# EAGLE schematic LautIOProto2 (EAGLE 9.6.2)

## Sheet 1 of 8
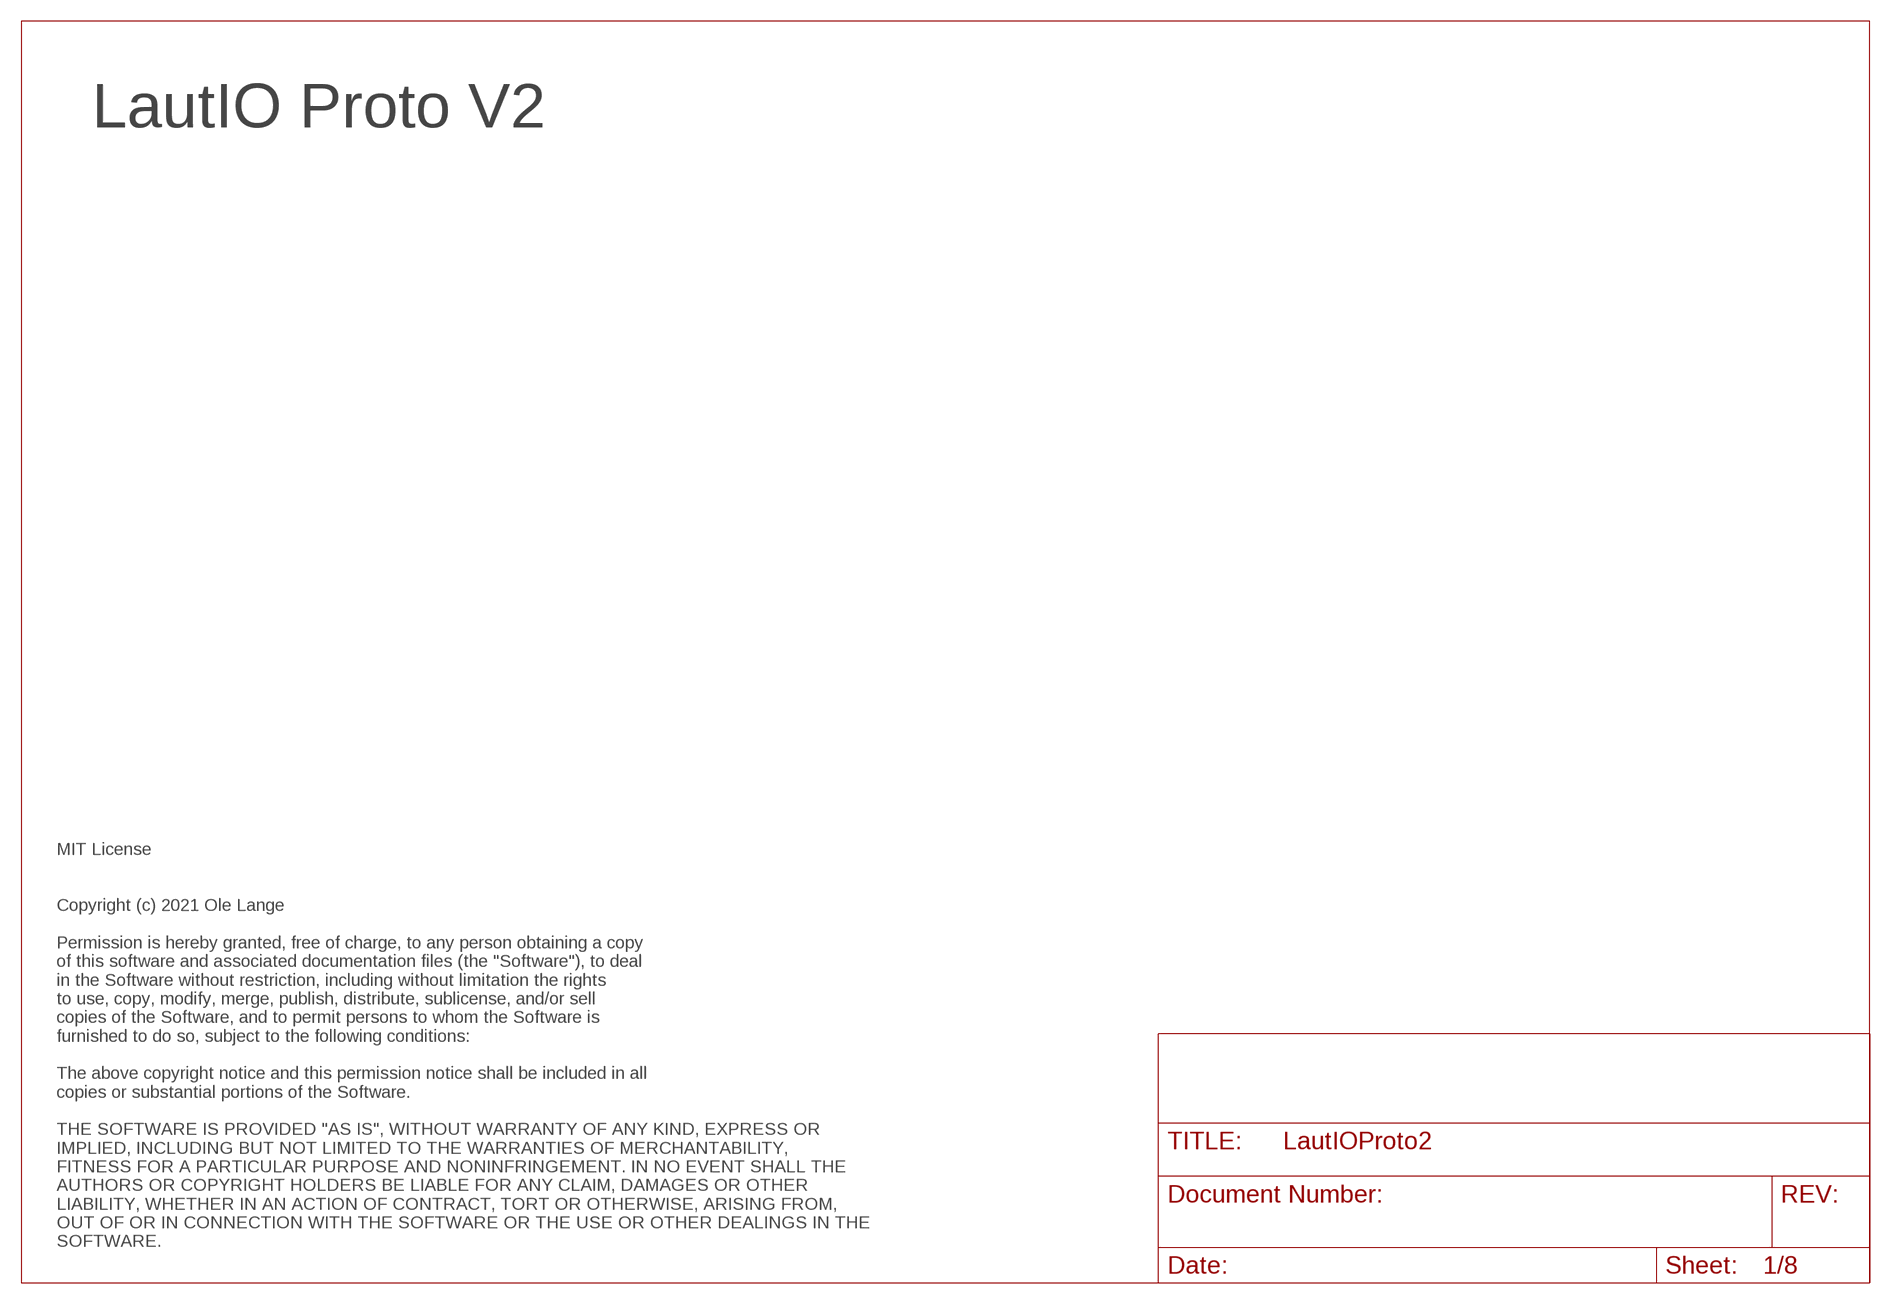
[diagram p0: schematic, sheet 1]

### Notes on the sheet
- LautIO Proto V2
- MIT License
  
  
  Copyright (c) 2021 Ole Lange
  
  Permission is hereby granted, free of charge, to any person obtaining a copy
  of this software and associated documentation files (the "Software"), to deal
  in the Software without restriction, including without limitation the rights
  to use, copy, modify, merge, publish, distribute, sublicense, and/or sell
  copies of the Software, and to permit persons to whom the Software is
  furnished to do so, subject to the following conditions:
  
  The above copyright notice and this permission notice shall be included in all
  copies or substantial portions of the Software.
  
  THE SOFTWARE IS PROVIDED "AS IS", WITHOUT WARRANTY OF ANY KIND, EXPRESS OR
  IMPLIED, INCLUDING BUT NOT LIMITED TO THE WARRANTIES OF MERCHANTABILITY,
  FITNESS FOR A PARTICULAR PURPOSE AND NONINFRINGEMENT. IN NO EVENT SHALL THE
  AUTHORS OR COPYRIGHT HOLDERS BE LIABLE FOR ANY CLAIM, DAMAGES OR OTHER
  LIABILITY, WHETHER IN AN ACTION OF CONTRACT, TORT OR OTHERWISE, ARISING FROM,
  OUT OF OR IN CONNECTION WITH THE SOFTWARE OR THE USE OR OTHER DEALINGS IN THE
  SOFTWARE.

## Sheet 2 of 8
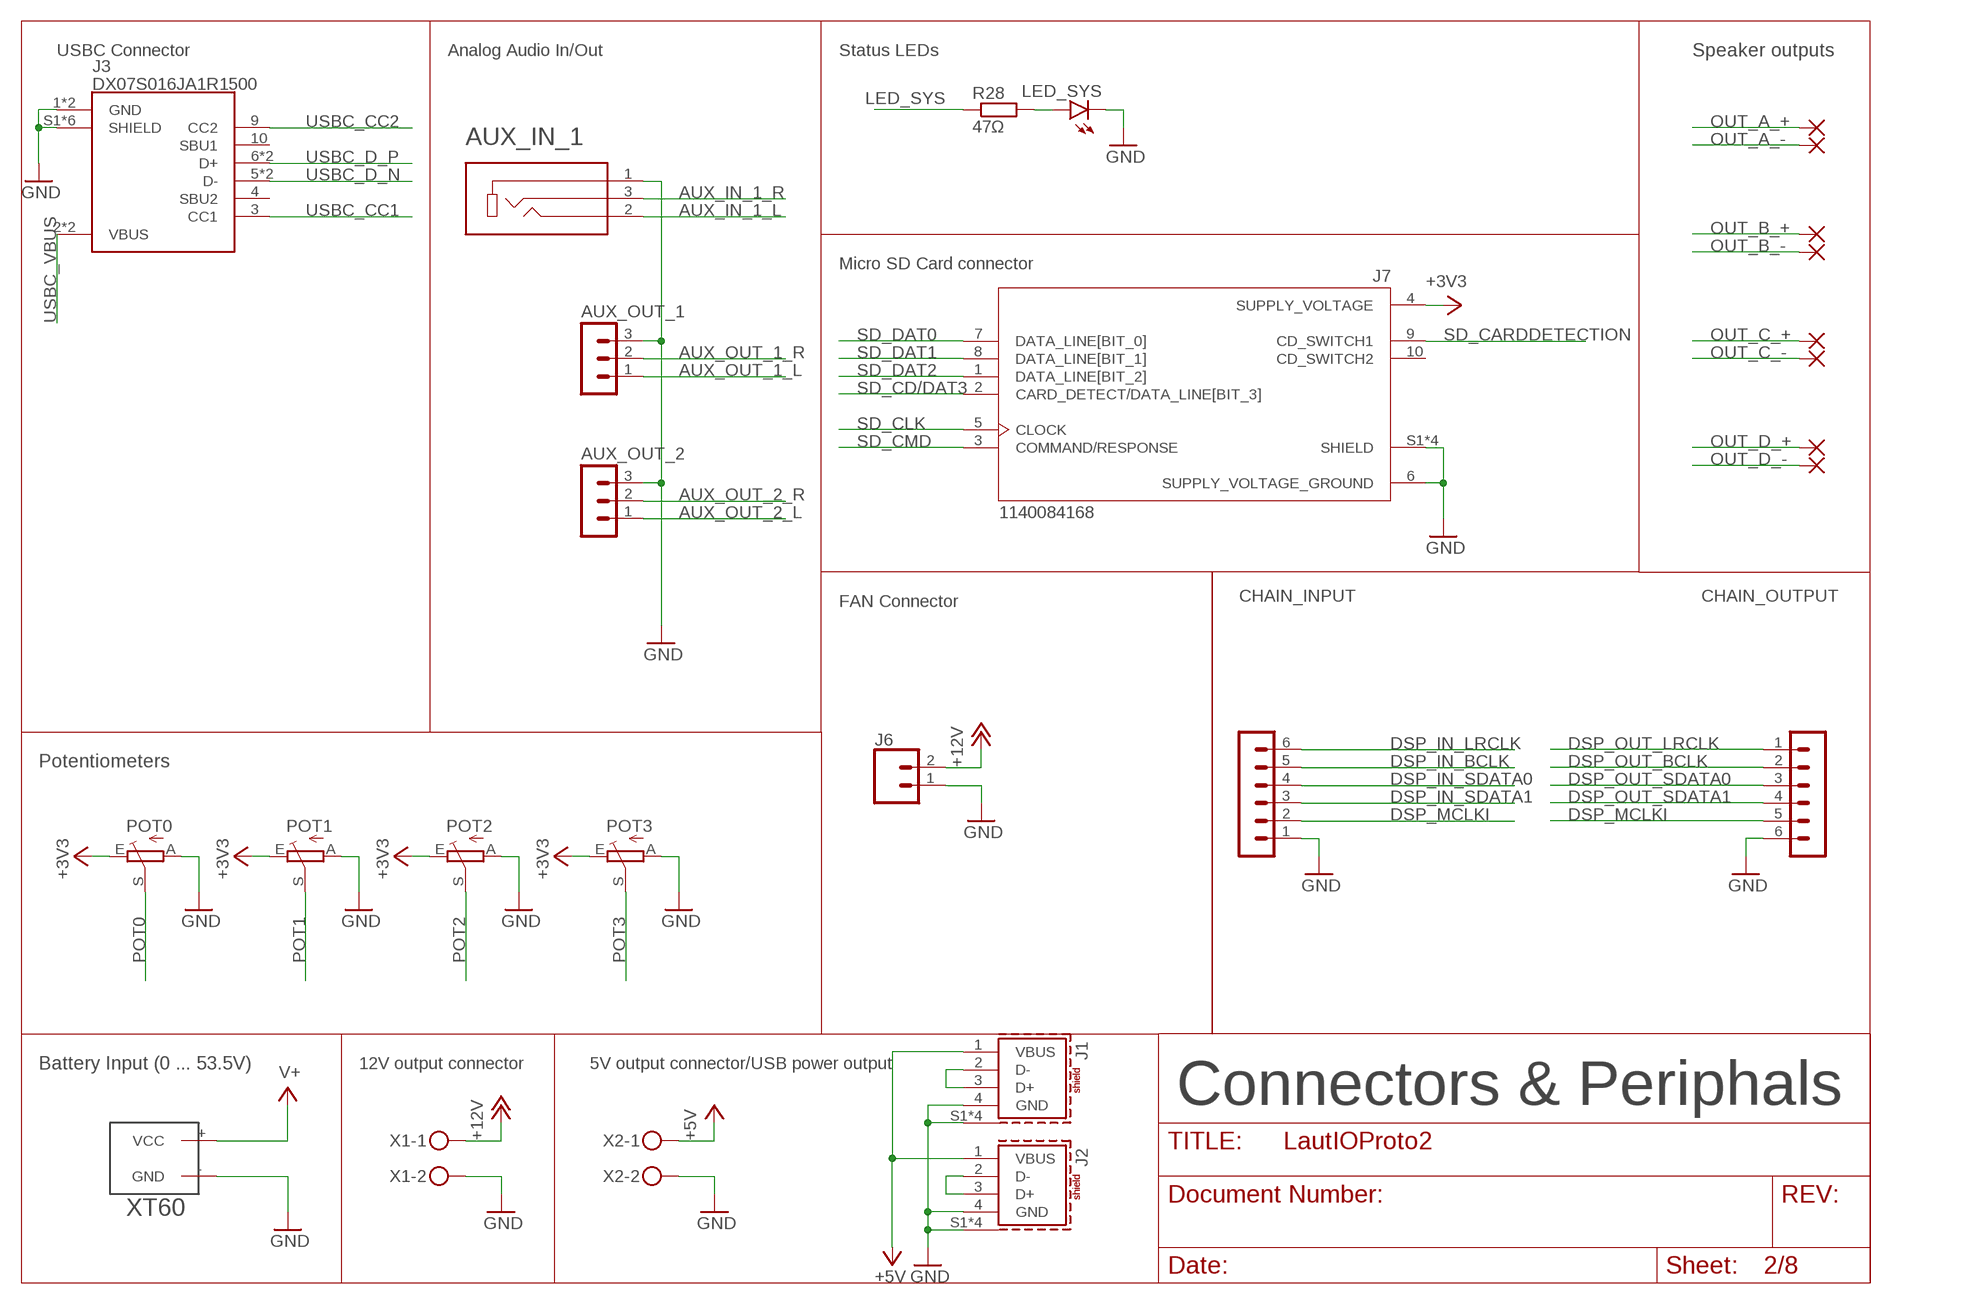
[diagram p1: schematic, sheet 2]

### Parts
AUX_IN_1  SJ1-3523N  [CUI_SJ1-3523N]
AUX_OUT_1  MA03-1  [MA03-1]
AUX_OUT_2  MA03-1  [MA03-1]
CHAIN_INPUT  MA06-1  [MA06-1]
CHAIN_OUTPUT  MA06-1  [MA06-1]
J1  614004134726  [614004134726]
J2  614004134726  [614004134726]
J3  DX07S016JA1R1500  [JAE_DX07S016JA1R1500]
J6  CONN_02PTH3  [1X02_LONGPADS]
J7  1140084168  [AMPHENOL_1140084168]
LED_SYS  LEDSML0603  [SML0603]
PAD1  SMD2  [SMD1,27-2,54]
PAD2  SMD2  [SMD1,27-2,54]
PAD3  SMD2  [SMD1,27-2,54]
PAD4  SMD2  [SMD1,27-2,54]
PAD5  SMD2  [SMD1,27-2,54]
PAD6  SMD2  [SMD1,27-2,54]
PAD7  SMD2  [SMD1,27-2,54]
PAD8  SMD2  [SMD1,27-2,54]
POT0  TRIM_EU-CIP20C-6MM  [CIP20C-6MM]
POT1  TRIM_EU-CIP20C-6MM  [CIP20C-6MM]
POT2  TRIM_EU-CIP20C-6MM  [CIP20C-6MM]
POT3  TRIM_EU-CIP20C-6MM  [CIP20C-6MM]
R28  47Ω  R-EU_R0603  [R0603]
U$1  XT60  [XT60]
X1  MKDSN1,5/2-5,08  [MKDSN1,5/2-5,08]
X2  MKDSN1,5/2-5,08  [MKDSN1,5/2-5,08]

### Nets
+3V3: J7.4(SUPPLY_VOLTAGE) POT0.E POT1.E POT2.E POT3.E ; also sheet 3,4,5,6,8
+5V: J1.1(VBUS) J2.1(VBUS) X2.1 ; also sheet 3
+12V: J6.2 X1.1 ; also sheet 3,6,8
AUX_IN_1_L: AUX_IN_1.2 ; also sheet 5
AUX_IN_1_R: AUX_IN_1.3 ; also sheet 5
AUX_OUT_1_L: AUX_OUT_1.1 ; also sheet 5
AUX_OUT_1_R: AUX_OUT_1.2 ; also sheet 5
AUX_OUT_2_L: AUX_OUT_2.1 ; also sheet 5
AUX_OUT_2_R: AUX_OUT_2.2 ; also sheet 5
DSP_IN_BCLK: CHAIN_INPUT.5 ; also sheet 5
DSP_IN_LRCLK: CHAIN_INPUT.6 ; also sheet 5
DSP_IN_SDATA0: CHAIN_INPUT.4 ; also sheet 5
DSP_IN_SDATA1: CHAIN_INPUT.3 ; also sheet 5
DSP_MCLKI: CHAIN_INPUT.2 CHAIN_OUTPUT.5 ; also sheet 5
DSP_OUT_BCLK: CHAIN_OUTPUT.2 ; also sheet 5
DSP_OUT_LRCLK: CHAIN_OUTPUT.1 ; also sheet 5
DSP_OUT_SDATA0: CHAIN_OUTPUT.3 ; also sheet 5
DSP_OUT_SDATA1: CHAIN_OUTPUT.4 ; also sheet 5
GND: AUX_IN_1.1 AUX_OUT_1.3 AUX_OUT_2.3 CHAIN_INPUT.1 CHAIN_OUTPUT.6 J1.4(GND) J1.S1(SHIELD) J1.S2(SHIELD) J1.S3(SHIELD) J1.S4(SHIELD) J2.4(GND) J2.S1(SHIELD) J2.S2(SHIELD) J2.S3(SHIELD) J2.S4(SHIELD) J3.1(GND) J3.12(GND) J3.S1(SHIELD) J3.S2(SHIELD) J3.S3(SHIELD) J3.S4(SHIELD) J3.S5(SHIELD) J3.S6(SHIELD) J6.1 J7.6(SUPPLY_VOLTAGE_GROUND) J7.S1(SHIELD) J7.S2(SHIELD) J7.S3(SHIELD) J7.S4(SHIELD) LED_SYS.C POT0.A POT1.A POT2.A POT3.A U$1.-(GND) X1.2 X2.2 ; also sheet 3,4,5,6,7,8
LED_SYS: R28.1 ; also sheet 4
N$3: J2.2(D-) J2.3(D+)
N$4: J1.2(D-) J1.3(D+)
N$57: LED_SYS.A R28.2
OUT_A_+: PAD1.1(P) ; also sheet 7
OUT_A_-: PAD2.1(P) ; also sheet 7
OUT_B_+: PAD4.1(P) ; also sheet 7
OUT_B_-: PAD3.1(P) ; also sheet 7
OUT_C_+: PAD5.1(P) ; also sheet 7
OUT_C_-: PAD6.1(P) ; also sheet 7
OUT_D_+: PAD8.1(P) ; also sheet 7
OUT_D_-: PAD7.1(P) ; also sheet 7
POT0: POT0.S ; also sheet 5
POT1: POT1.S ; also sheet 5
POT2: POT2.S ; also sheet 5
POT3: POT3.S ; also sheet 5
SD_CARDDETECTION: J7.9(CD_SWITCH1) ; also sheet 4
SD_CD/DAT3: J7.2(CARD_DETECT/DATA_LINE[BIT_3]) ; also sheet 4
SD_CLK: J7.5(CLOCK) ; also sheet 4
SD_CMD: J7.3(COMMAND/RESPONSE) ; also sheet 4
SD_DAT0: J7.7(DATA_LINE[BIT_0]) ; also sheet 4
SD_DAT1: J7.8(DATA_LINE[BIT_1]) ; also sheet 4
SD_DAT2: J7.1(DATA_LINE[BIT_2]) ; also sheet 4
USBC_CC1: J3.3(CC1) ; also sheet 4
USBC_CC2: J3.9(CC2) ; also sheet 4
USBC_D_N [usbbd]: J3.5(D-) J3.8(D-) ; also sheet 4
USBC_D_P [usbbd]: J3.6(D+) J3.7(D+) ; also sheet 4
USBC_VBUS: J3.2(VBUS) J3.11(VBUS) ; also sheet 4
V+: U$1.+(VCC) ; also sheet 3,6,8
Unconnected: J3.4(SBU2) J3.10(SBU1) J7.10(CD_SWITCH2)

### Notes on the sheet
- USBC Connector | Analog Audio In/Out | Status LEDs | Speaker outputs
- Micro SD Card connector
- FAN Connector
- Potentiometers
- Battery Input (0 ... 53.5V) | 12V output connector | 5V output connector/USB power output
- Connectors & Periphals

## Sheet 3 of 8
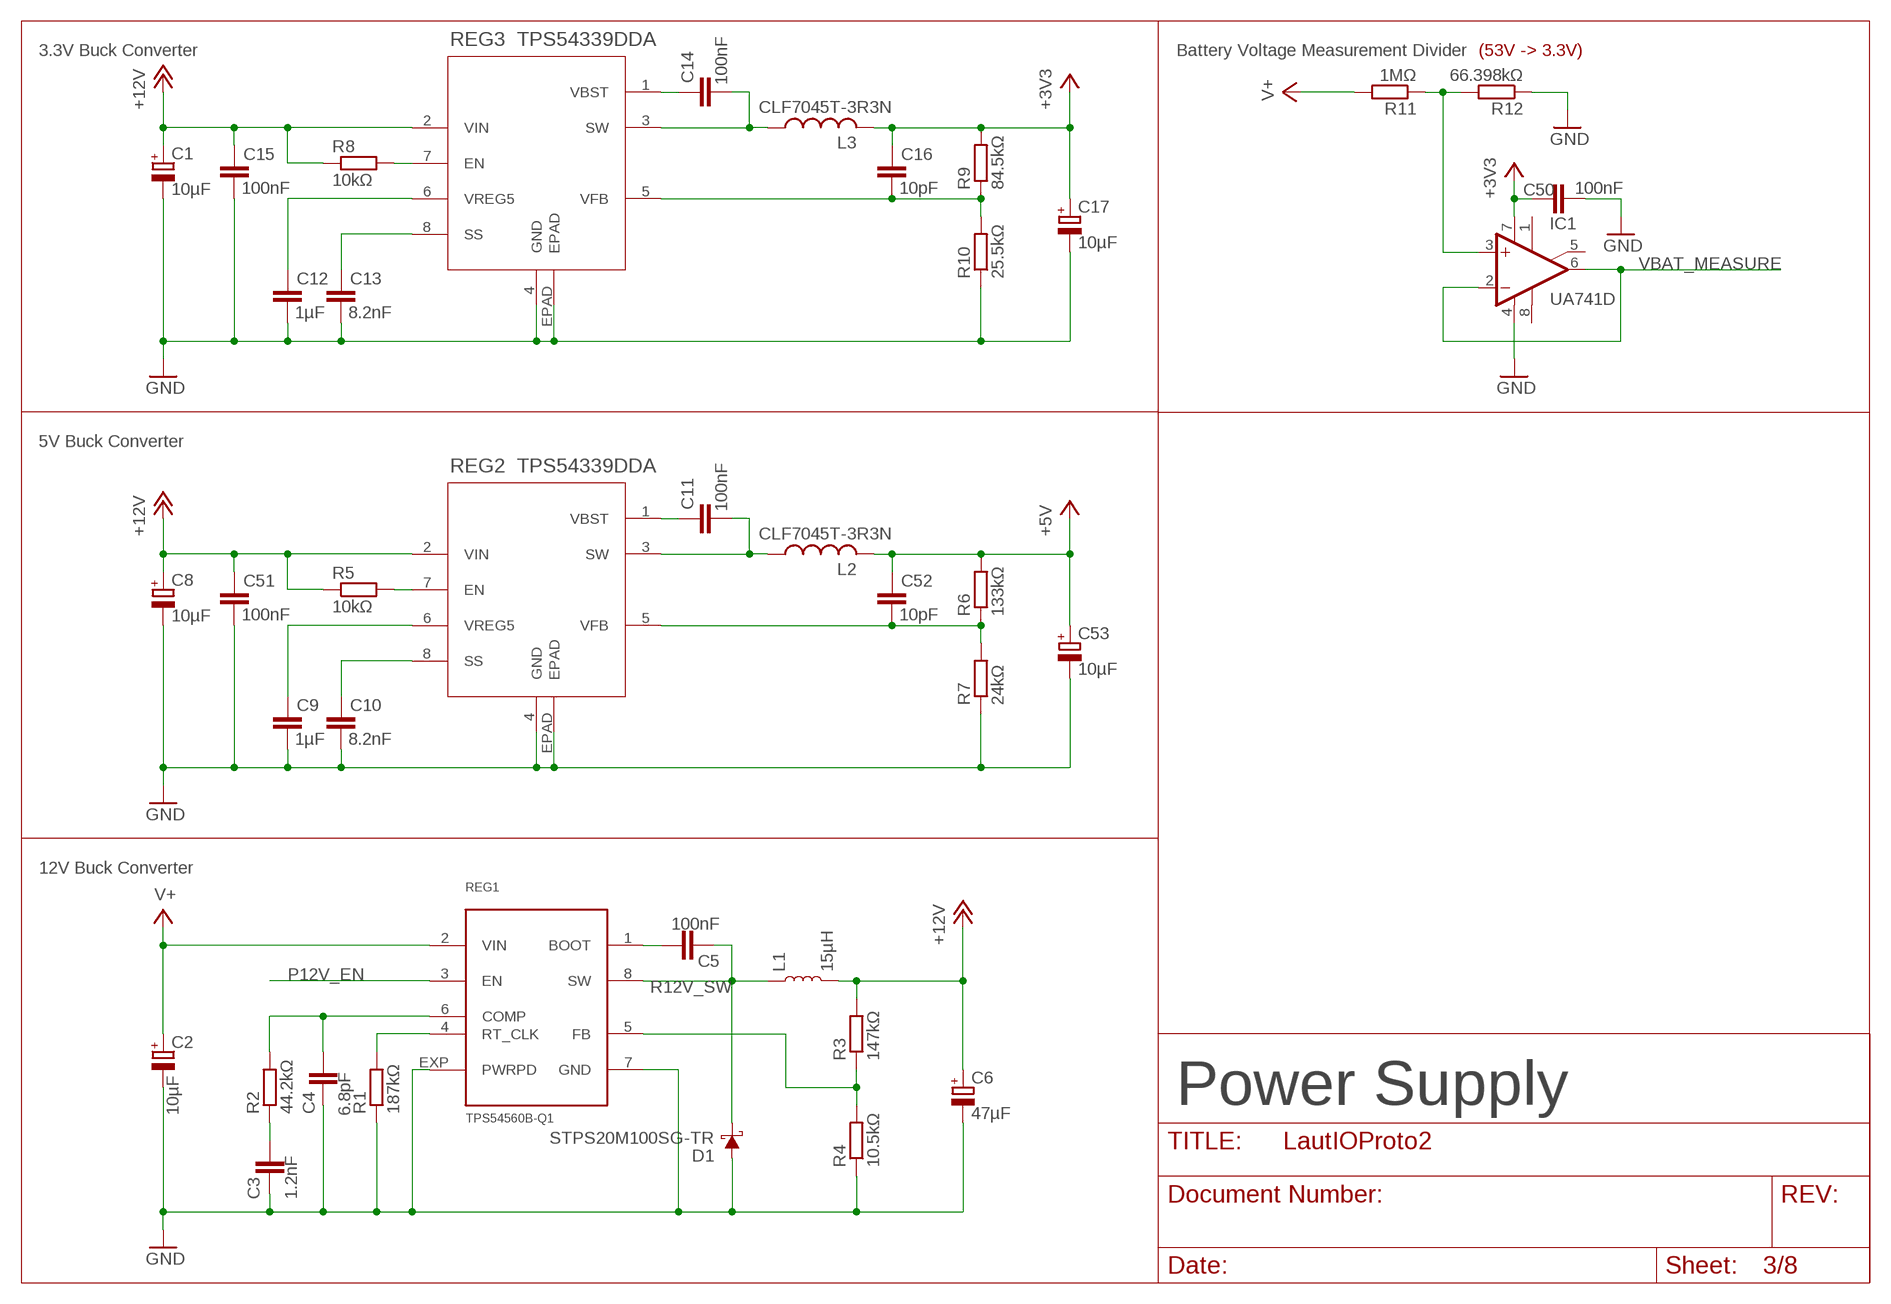
[diagram p2: schematic, sheet 3]

### Parts
C1  10µF  CPOL-EU153CLV-0605  [153CLV-0605]
C2  10µF  CPOL-EU153CLV-0605  [153CLV-0605]
C3  1.2nF  C-EUC0603  [C0603]
C4  6.8pF  C-EUC0603  [C0603]
C5  100nF  C-EUC0603  [C0603]
C6  47µF  CPOL-EU153CLV-0807  [153CLV-0807]
C8  10µF  CPOL-EU153CLV-0605  [153CLV-0605]
C9  1µF  C-EUC3216  [C3216]
C10  8.2nF  C-EUC0603  [C0603]
C11  100nF  C-EUC0603  [C0603]
C12  1µF  C-EUC3216  [C3216]
C13  8.2nF  C-EUC0603  [C0603]
C14  100nF  C-EUC0603  [C0603]
C15  100nF  C-EUC0603  [C0603]
C16  10pF  C-EUC0603  [C0603]
C17  10µF  CPOL-EU153CLV-0605  [153CLV-0605]
C50  100nF  C-EUC0603  [C0603]
C51  100nF  C-EUC0603  [C0603]
C52  10pF  C-EUC0603  [C0603]
C53  10µF  CPOL-EU153CLV-0605  [153CLV-0605]
D1  STPS20M100SG-TR  [TO-263/D2PAK]
IC1  UA741D  [SO08]
L1  15µH  INDUCTOR-SDR13-27UH  [INDUCTOR_SDR1307]
L2  CLF7045T-3R3N  L-USL5650M  [L5650M]
L3  CLF7045T-3R3N  L-USL5650M  [L5650M]
R1  187kΩ  R-EU_R0603  [R0603]
R2  44.2kΩ  R-EU_R0603  [R0603]
R3  147kΩ  R-EU_R0603  [R0603]
R4  10.5kΩ  R-EU_R0603  [R0603]
R5  10kΩ  R-EU_R0603  [R0603]
R6  133kΩ  R-EU_R0603  [R0603]
R7  24kΩ  R-EU_R0603  [R0603]
R8  10kΩ  R-EU_R0603  [R0603]
R9  84.5kΩ  R-EU_R0603  [R0603]
R10  25.5kΩ  R-EU_R0603  [R0603]
R11  1MΩ  R-EU_R0603  [R0603]
R12  66.398kΩ  R-EU_R0603  [R0603]
REG1  TPS54560B-Q1  [HSOP8]
REG2  TPS54339DDA  [DDA8_3P1X2P4_TEX]
REG3  TPS54339DDA  [DDA8_3P1X2P4_TEX]

### Nets
+3V3: C16.1 C17.+ C50.1 IC1.7(V+) L3.2 R9.2 ; also sheet 2,4,5,6,8
+5V: C52.1 C53.+ L2.2 R6.2 ; also sheet 2
+12V: C1.+ C6.+ C8.+ C15.1 C51.1 L1.P$2 R3.2 R5.1 R8.1 REG2.2(VIN) REG3.2(VIN) ; also sheet 2,6,8
GND: C1.- C2.- C3.2 C4.2 C6.- C8.- C9.2 C10.2 C12.2 C13.2 C15.2 C17.- C50.2 C51.2 C53.- D1.1(A) D1.3(A) IC1.4(V-) R1.1 R4.1 R7.1 R10.1 R12.1 REG1.7(GND) REG1.EXP(PWRPD) REG2.4(GND) REG2.EPAD REG3.4(GND) REG3.EPAD ; also sheet 2,4,5,6,7,8
N$1: R1.2 REG1.4(RT_CLK)
N$2: C4.1 R2.2 REG1.6(COMP)
N$5: C3.1 R2.1
N$6: C5.1 REG1.1(BOOT)
N$7: R3.1 R4.2 REG1.5(FB)
N$8: R5.2 REG2.7(EN)
N$9: C10.1 REG2.8(SS)
N$10: C9.1 REG2.6(VREG5)
N$11: C11.1 REG2.1(VBST)
N$12: R8.2 REG3.7(EN)
N$13: C14.1 REG3.1(VBST)
N$14: C13.1 REG3.8(SS)
N$15: C12.1 REG3.6(VREG5)
N$16: C14.2 L3.1 REG3.3(SW)
N$17: C16.2 R9.1 R10.2 REG3.5(VFB)
N$28: IC1.3(+IN) R11.1 R12.2
N$29: C11.2 L2.1 REG2.3(SW)
N$31: C52.2 R6.1 R7.2 REG2.5(VFB)
P12V_EN: REG1.3(EN)
R12V_SW: C5.2 D1.2(C) L1.P$1 REG1.8(SW)
V+: C2.+ R11.2 REG1.2(VIN) ; also sheet 2,6,8
VBAT_MEASURE: IC1.2(-IN) IC1.6(OUT) ; also sheet 4
Unconnected: IC1.1(ON1) IC1.5(ON2) IC1.8(OPT)

### Notes on the sheet
- 3.3V Buck Converter | Battery Voltage Measurement Divider | (53V -> 3.3V)
- 5V Buck Converter
- 12V Buck Converter
- Power Supply

## Sheet 4 of 8
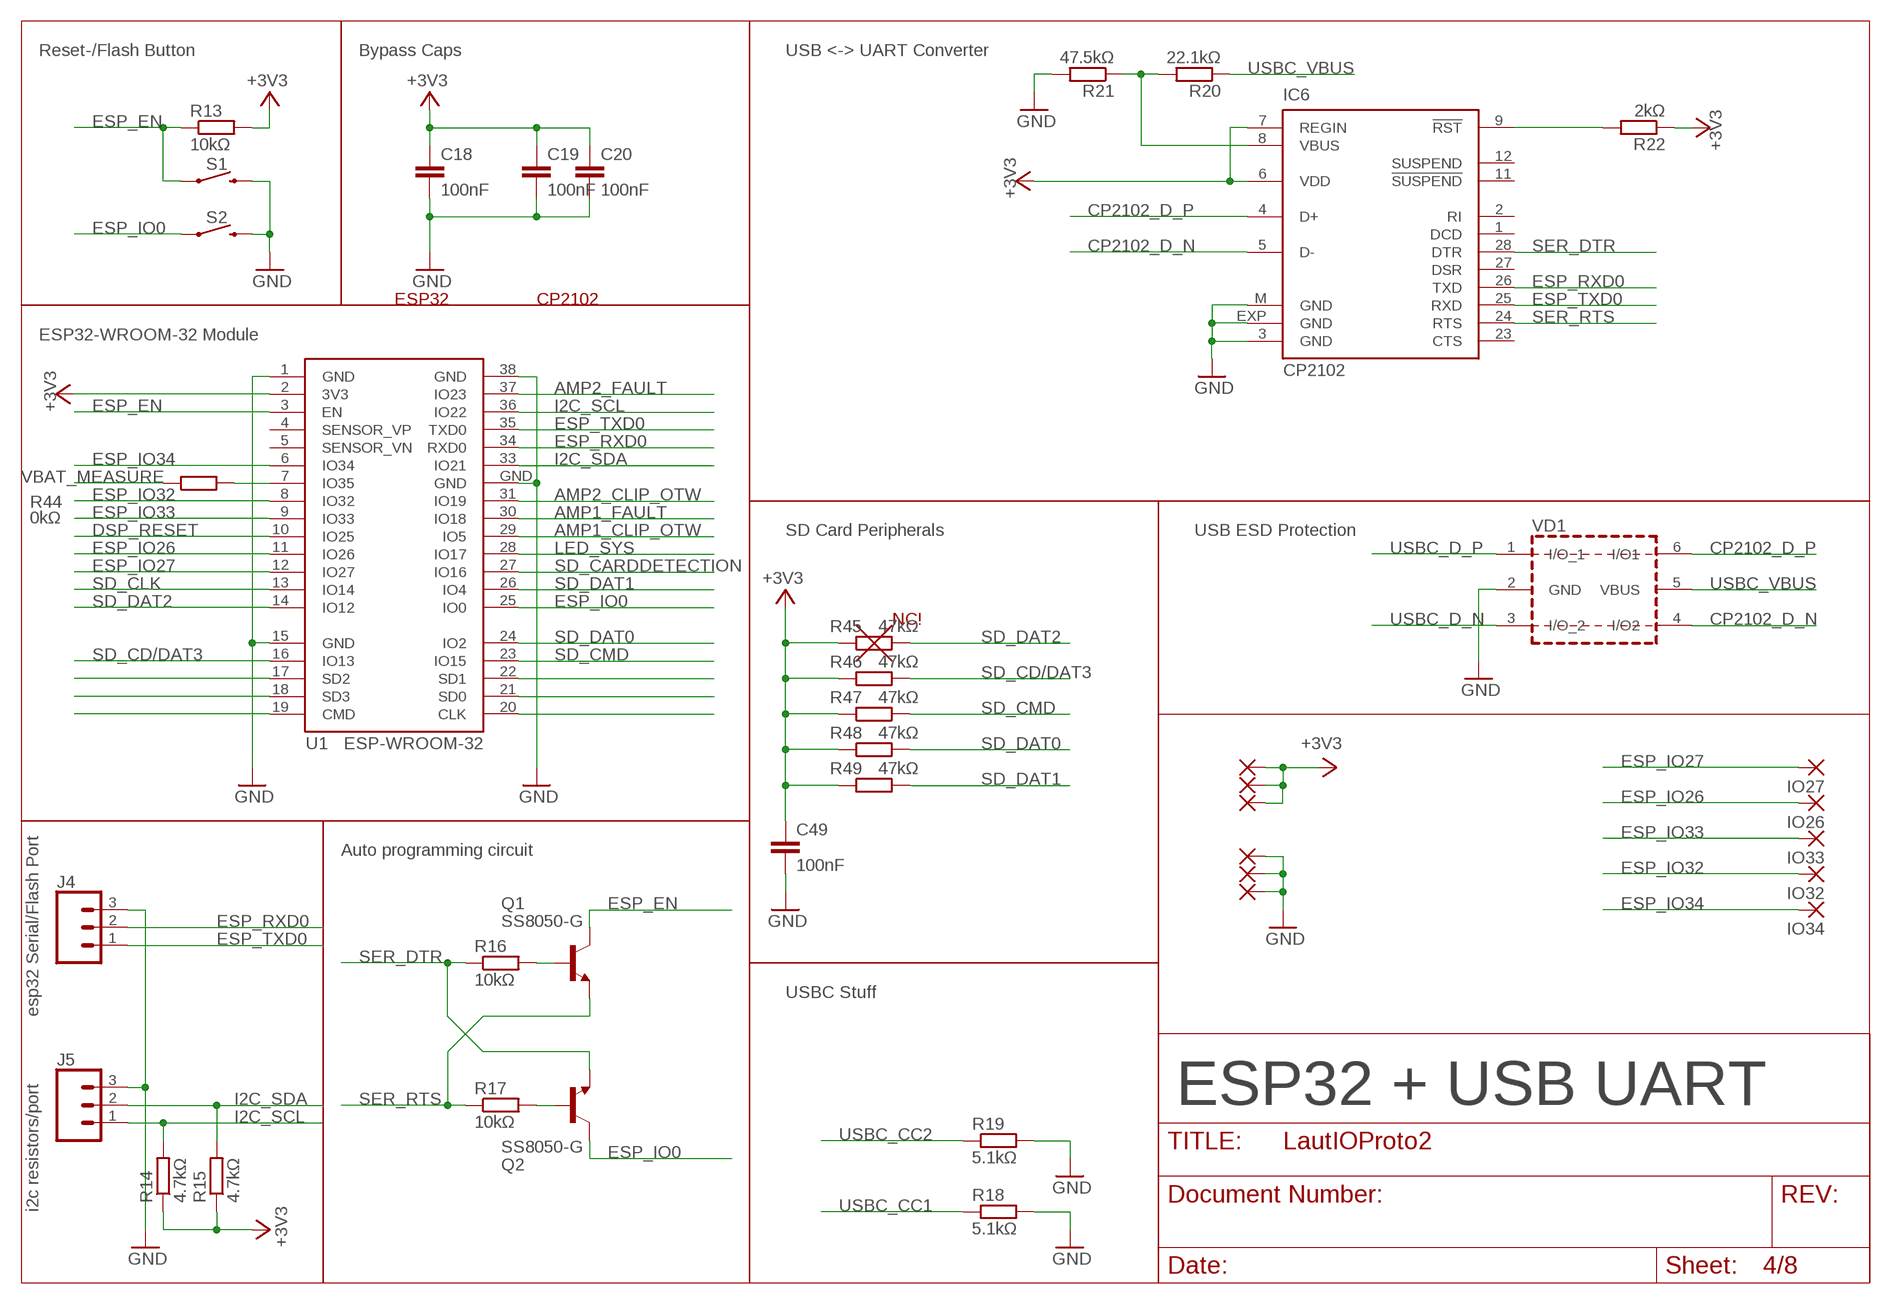
[diagram p3: schematic, sheet 4]

### Parts
3V3IO  SMD2  [SMD1,27-2,54]
C18  100nF  C-EUC0603  [C0603]
C19  100nF  C-EUC0603  [C0603]
C20  100nF  C-EUC0603  [C0603]
C49  100nF  C-EUC0603  [C0603]
IC6  CP2102  [MLP28]
IO1  SMD2  [SMD1,27-2,54]
IO2  SMD2  [SMD1,27-2,54]
IO3  SMD2  [SMD1,27-2,54]
IO4  SMD2  [SMD1,27-2,54]
IO5  SMD2  [SMD1,27-2,54]
IO26  SMD2  [SMD1,27-2,54]
IO27  SMD2  [SMD1,27-2,54]
IO32  SMD2  [SMD1,27-2,54]
IO33  SMD2  [SMD1,27-2,54]
IO34  SMD2  [SMD1,27-2,54]
J4  455-1750-1-ND  CONN_03  [1X03]
J5  455-1750-1-ND  CONN_03  [1X03]
Q1  SS8050-G  BC849SMD  [SOT23-BEC]
Q2  SS8050-G  BC849SMD  [SOT23-BEC]
R13  10kΩ  R-EU_R0603  [R0603]
R14  4.7kΩ  R-EU_R0603  [R0603]
R15  4.7kΩ  R-EU_R0603  [R0603]
R16  10kΩ  R-EU_R0603  [R0603]
R17  10kΩ  R-EU_R0603  [R0603]
R18  5.1kΩ  R-EU_R0603  [R0603]
R19  5.1kΩ  R-EU_R0603  [R0603]
R20  22.1kΩ  R-EU_R0603  [R0603]
R21  47.5kΩ  R-EU_R0603  [R0603]
R22  2kΩ  R-EU_R0603  [R0603]
R44  0kΩ  R-EU_R0603  [R0603]
R45  47kΩ  R-EU_R0603  [R0603]
R46  47kΩ  R-EU_R0603  [R0603]
R47  47kΩ  R-EU_R0603  [R0603]
R48  47kΩ  R-EU_R0603  [R0603]
R49  47kΩ  R-EU_R0603  [R0603]
S1  MOMENTARY-SWITCH-SPST-SMD-6.2MM-TALL  [TACTILE_SWITCH_SMD_6.2MM_TALL]
S2  MOMENTARY-SWITCH-SPST-SMD-6.2MM-TALL  [TACTILE_SWITCH_SMD_6.2MM_TALL]
U1  ESP-WROOM-32  [ESP-WROOM-32]
VD1  USBLC6-2SC6  [SOT-23-6L]

### Nets
+3V3: 3V3IO.1(P) C18.1 C19.1 C20.1 C49.1 IC6.6(VDD) IC6.7(REGIN) IO2.1(P) IO3.1(P) R13.2 R14.1 R15.1 R22.1 R45.1 R46.1 R47.1 R48.1 R49.1 U1.2(3V3) ; also sheet 2,3,5,6,8
AMP1_CLIP_OTW: U1.29(IO5) ; also sheet 6
AMP1_FAULT: U1.30(IO18) ; also sheet 6
AMP2_CLIP_OTW: U1.31(IO19) ; also sheet 8
AMP2_FAULT: U1.37(IO23) ; also sheet 8
CP2102_D_N [usbad]: IC6.5(D-) VD1.4(I/O2)
CP2102_D_P [usbad]: IC6.4(D+) VD1.6(I/O1)
DSP_RESET: U1.10(IO25) ; also sheet 5
ESP_EN: Q1.C R13.1 S1.A2 U1.3(EN)
ESP_IO0: Q2.C S2.A2 U1.25(IO0)
ESP_IO26: IO26.1(P) U1.11(IO26)
ESP_IO27: IO27.1(P) U1.12(IO27)
ESP_IO32: IO32.1(P) U1.8(IO32)
ESP_IO33: IO33.1(P) U1.9(IO33)
ESP_IO34: IO34.1(P) U1.6(IO34)
ESP_RXD0: IC6.26(TXD) J4.2 U1.34(RXD0)
ESP_TXD0: IC6.25(RXD) J4.1 U1.35(TXD0)
GND: C18.2 C19.2 C20.2 C49.2 IC6.3(GND) IC6.EXP(GND) IC6.M(GND) IO1.1(P) IO4.1(P) IO5.1(P) J4.3 J5.3 R18.2 R19.2 R21.2 S1.B2 S2.B2 U1.1(GND) U1.15(GND) U1.38(GND) U1.GND VD1.2(GND) ; also sheet 2,3,5,6,7,8
I2C_SCL: J5.1 R14.2 U1.36(IO22) ; also sheet 5
I2C_SDA: J5.2 R15.2 U1.33(IO21) ; also sheet 5
LED_SYS: U1.28(IO17) ; also sheet 2
N$30: Q1.B R16.2
N$33: U1.22(SD1)
N$34: U1.21(SD0)
N$35: U1.20(CLK)
N$38: R44.2 U1.7(IO35)
N$47: U1.17(SD2)
N$48: U1.18(SD3)
N$49: U1.19(CMD)
N$50: Q2.B R17.2
N$51: IC6.8(VBUS) R20.2 R21.1
N$52: IC6.9(!RST) R22.2
SD_CARDDETECTION: U1.27(IO16) ; also sheet 2
SD_CD/DAT3: R46.2 U1.16(IO13) ; also sheet 2
SD_CLK: U1.13(IO14) ; also sheet 2
SD_CMD: R47.2 U1.23(IO15) ; also sheet 2
SD_DAT0: R48.2 U1.24(IO2) ; also sheet 2
SD_DAT1: R49.2 U1.26(IO4) ; also sheet 2
SD_DAT2: R45.2 U1.14(IO12) ; also sheet 2
SER_DTR: IC6.28(DTR) Q2.E R16.1
SER_RTS: IC6.24(RTS) Q1.E R17.1
USBC_CC1: R18.1 ; also sheet 2
USBC_CC2: R19.1 ; also sheet 2
USBC_D_N [usbbd]: VD1.3(I/O_2) ; also sheet 2
USBC_D_P [usbbd]: VD1.1(I/O_1) ; also sheet 2
USBC_VBUS: R20.1 VD1.5(VBUS) ; also sheet 2
VBAT_MEASURE: R44.1 ; also sheet 3
Unconnected: IC6.1(DCD) IC6.2(RI) IC6.11(!SUSPEND) IC6.12(SUSPEND) IC6.23(CTS) IC6.27(DSR) U1.4(SENSOR_VP) U1.5(SENSOR_VN)

### Notes on the sheet
- Reset-/Flash Button | Bypass Caps | USB <-> UART Converter
- ESP32 | CP2102
- ESP32-WROOM-32 Module
- SD Card Peripherals | USB ESD Protection
- NC!
- Auto programming circuit
- USBC Stuff
- esp32 Serial/Flash Port
- ESP32 + USB UART
- i2c resistors/port

## Sheet 5 of 8
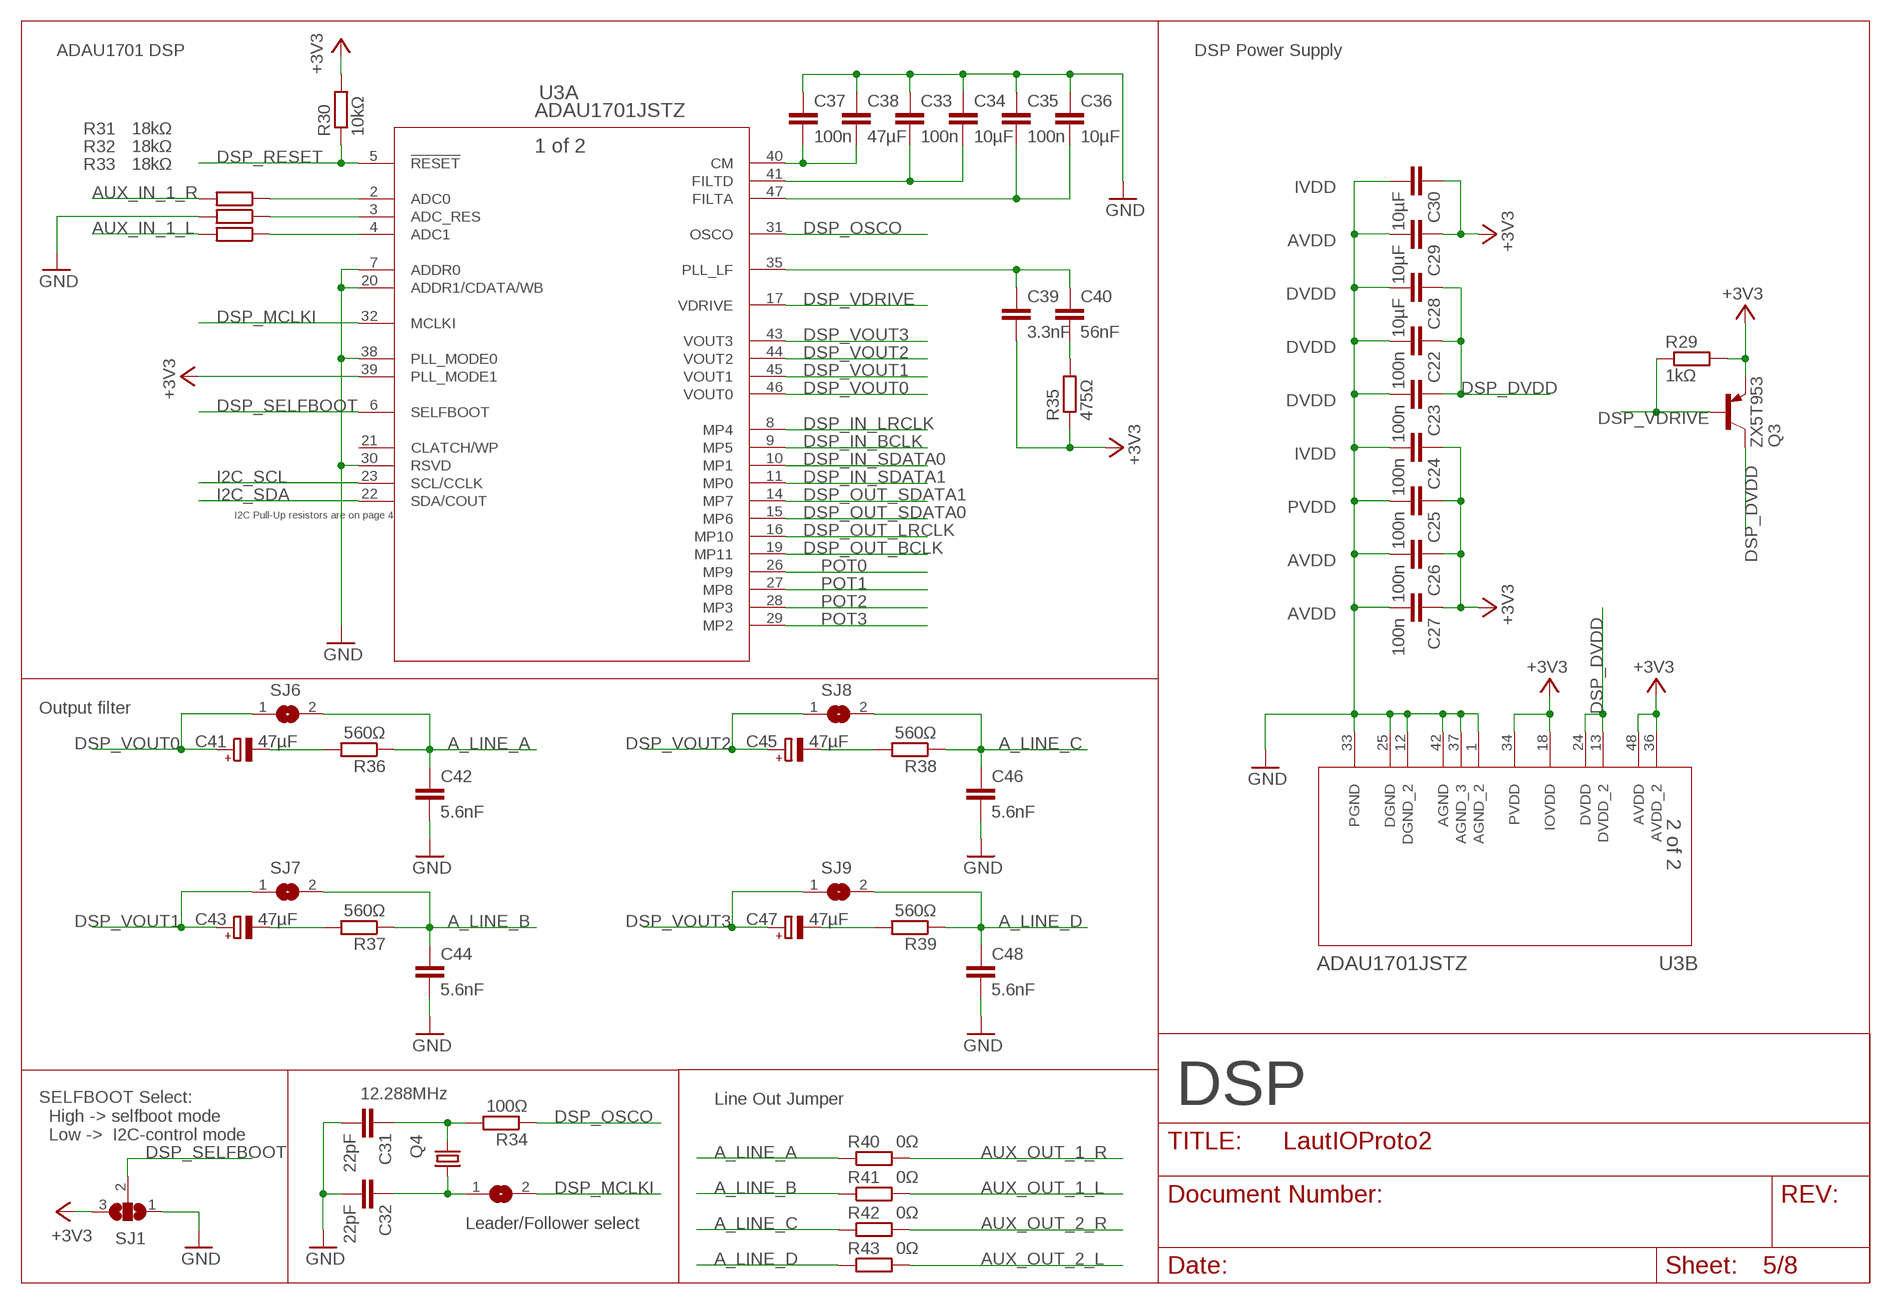
[diagram p4: schematic, sheet 5]

### Parts
C22  100n  C-EUC0603  [C0603]
C23  100n  C-EUC0603  [C0603]
C24  100n  C-EUC0603  [C0603]
C25  100n  C-EUC0603  [C0603]
C26  100n  C-EUC0603  [C0603]
C27  100n  C-EUC0603  [C0603]
C28  10µF  C-EUC1206K  [C1206K]
C29  10µF  C-EUC1206K  [C1206K]
C30  10µF  C-EUC1206K  [C1206K]
C31  22pF  C-EUC0603  [C0603]
C32  22pF  C-EUC0603  [C0603]
C33  100n  C-EUC0603  [C0603]
C34  10µF  C-EUC1206K  [C1206K]
C35  100n  C-EUC0603  [C0603]
C36  10µF  C-EUC1206K  [C1206K]
C37  100n  C-EUC0603  [C0603]
C38  47µF  C-EUC1206K  [C1206K]
C39  3.3nF  C-EUC0603  [C0603]
C40  56nF  C-EUC0603  [C0603]
C41  47µF  CPOL-EU153CLV-0605  [153CLV-0605]
C42  5.6nF  C-EUC0603  [C0603]
C43  47µF  CPOL-EU153CLV-0605  [153CLV-0605]
C44  5.6nF  C-EUC0603  [C0603]
C45  47µF  CPOL-EU153CLV-0605  [153CLV-0605]
C46  5.6nF  C-EUC0603  [C0603]
C47  47µF  CPOL-EU153CLV-0605  [153CLV-0605]
C48  5.6nF  C-EUC0603  [C0603]
Q3  ZX5T953  FZT753SMD  [SOT223]
Q4  12.288MHz  CSM-7X-DU  [CSM-7X-DU]
R29  1kΩ  R-EU_R0603  [R0603]
R30  10kΩ  R-EU_R0603  [R0603]
R31  18kΩ  R-EU_R0603  [R0603]
R32  18kΩ  R-EU_R0603  [R0603]
R33  18kΩ  R-EU_R0603  [R0603]
R34  100Ω  R-EU_R0603  [R0603]
R35  475Ω  R-EU_R0603  [R0603]
R36  560Ω  R-EU_R0603  [R0603]
R37  560Ω  R-EU_R0603  [R0603]
R38  560Ω  R-EU_R0603  [R0603]
R39  560Ω  R-EU_R0603  [R0603]
R40  0Ω  R-EU_R0603  [R0603]
R41  0Ω  R-EU_R0603  [R0603]
R42  0Ω  R-EU_R0603  [R0603]
R43  0Ω  R-EU_R0603  [R0603]
SJ1  SJ2W  [SJ_2]
SJ2  SJ  [SJ]
SJ6  SJ  [SJ]
SJ7  SJ  [SJ]
SJ8  SJ  [SJ]
SJ9  SJ  [SJ]
U3  ADAU1701JSTZ  [ST_48_ADI]

### Nets
+3V3: C24.1 C25.1 C26.1 C27.1 C29.1 C30.1 C39.2 Q3.3(E) R29.2 R30.2 R35.1 SJ1.3 U3.18(B:IOVDD) U3.34(B:PVDD) U3.36(B:AVDD_2) U3.39(A:PLL_MODE1) U3.48(B:AVDD) ; also sheet 2,3,4,6,8
A_LINE_A: C42.1 R36.1 R40.1 SJ6.2 ; also sheet 6
A_LINE_B: C44.1 R37.1 R41.1 SJ7.2 ; also sheet 6
A_LINE_C: C46.1 R38.1 R42.1 SJ8.2 ; also sheet 8
A_LINE_D: C48.1 R39.1 R43.1 SJ9.2 ; also sheet 8
AUX_IN_1_L: R33.2 ; also sheet 2
AUX_IN_1_R: R31.2 ; also sheet 2
AUX_OUT_1_L: R41.2 ; also sheet 2
AUX_OUT_1_R: R40.2 ; also sheet 2
AUX_OUT_2_L: R43.2 ; also sheet 2
AUX_OUT_2_R: R42.2 ; also sheet 2
CRYSTAL_MCLKI: C32.1 Q4.1 SJ2.1
DSP_DVDD: C22.1 C23.1 C28.1 Q3.2(C) Q3.4(C) U3.13(B:DVDD_2) U3.24(B:DVDD)
DSP_IN_BCLK: U3.9(A:MP5) ; also sheet 2
DSP_IN_LRCLK: U3.8(A:MP4) ; also sheet 2
DSP_IN_SDATA0: U3.10(A:MP1) ; also sheet 2
DSP_IN_SDATA1: U3.11(A:MP0) ; also sheet 2
DSP_MCLKI: SJ2.2 U3.32(A:MCLKI) ; also sheet 2
DSP_OSCO: R34.1 U3.31(A:OSCO)
DSP_OUT_BCLK: U3.19(A:MP11) ; also sheet 2
DSP_OUT_LRCLK: U3.16(A:MP10) ; also sheet 2
DSP_OUT_SDATA0: U3.15(A:MP6) ; also sheet 2
DSP_OUT_SDATA1: U3.14(A:MP7) ; also sheet 2
DSP_RESET: R30.1 U3.5(A:!RESET) ; also sheet 4
DSP_SELFBOOT: SJ1.2 U3.6(A:SELFBOOT)
DSP_VDRIVE: Q3.1(B) R29.1 U3.17(A:VDRIVE)
DSP_VOUT0: C41.+ SJ6.1 U3.46(A:VOUT0)
DSP_VOUT1: C43.+ SJ7.1 U3.45(A:VOUT1)
DSP_VOUT2: C45.+ SJ8.1 U3.44(A:VOUT2)
DSP_VOUT3: C47.+ SJ9.1 U3.43(A:VOUT3)
GND: C22.2 C23.2 C24.2 C25.2 C26.2 C27.2 C28.2 C29.2 C30.2 C31.2 C32.2 C33.1 C34.1 C35.1 C36.1 C37.1 C38.1 C42.2 C44.2 C46.2 C48.2 R32.2 SJ1.1 U3.1(B:AGND_2) U3.7(A:ADDR0) U3.12(B:DGND_2) U3.20(A:ADDR1/CDATA/WB) U3.25(B:DGND) U3.30(A:RSVD) U3.33(B:PGND) U3.37(B:AGND_3) U3.38(A:PLL_MODE0) U3.42(B:AGND) ; also sheet 2,3,4,6,7,8
I2C_SCL: U3.23(A:SCL/CCLK) ; also sheet 4
I2C_SDA: U3.22(A:SDA/COUT) ; also sheet 4
N$20: R31.1 U3.2(A:ADC0)
N$21: R32.1 U3.3(A:ADC_RES)
N$23: R33.1 U3.4(A:ADC1)
N$58: C31.1 Q4.2 R34.2
N$59: C33.2 C34.2 U3.41(A:FILTD)
N$60: C35.2 C36.2 U3.47(A:FILTA)
N$61: C37.2 C38.2 U3.40(A:CM)
N$62: C39.1 C40.1 U3.35(A:PLL_LF)
N$63: C40.2 R35.2
N$64: C41.- R36.2
N$65: C43.- R37.2
N$66: C45.- R38.2
N$67: C47.- R39.2
POT0: U3.26(A:MP9) ; also sheet 2
POT1: U3.27(A:MP8) ; also sheet 2
POT2: U3.28(A:MP3) ; also sheet 2
POT3: U3.29(A:MP2) ; also sheet 2
Unconnected: U3.21(A:CLATCH/WP)

### Notes on the sheet
- ADAU1701 DSP | DSP Power Supply
- IVDD
- AVDD
- DVDD
- DVDD
- DVDD
- IVDD
- PVDD
- I2C Pull-Up resistors are on page 4
- AVDD
- AVDD
- Output filter
- Line Out Jumper | DSP
- SELFBOOT Select:
    High -> selfboot mode
    Low ->  I2C-control mode
- Leader/Follower select

## Sheet 6 of 8
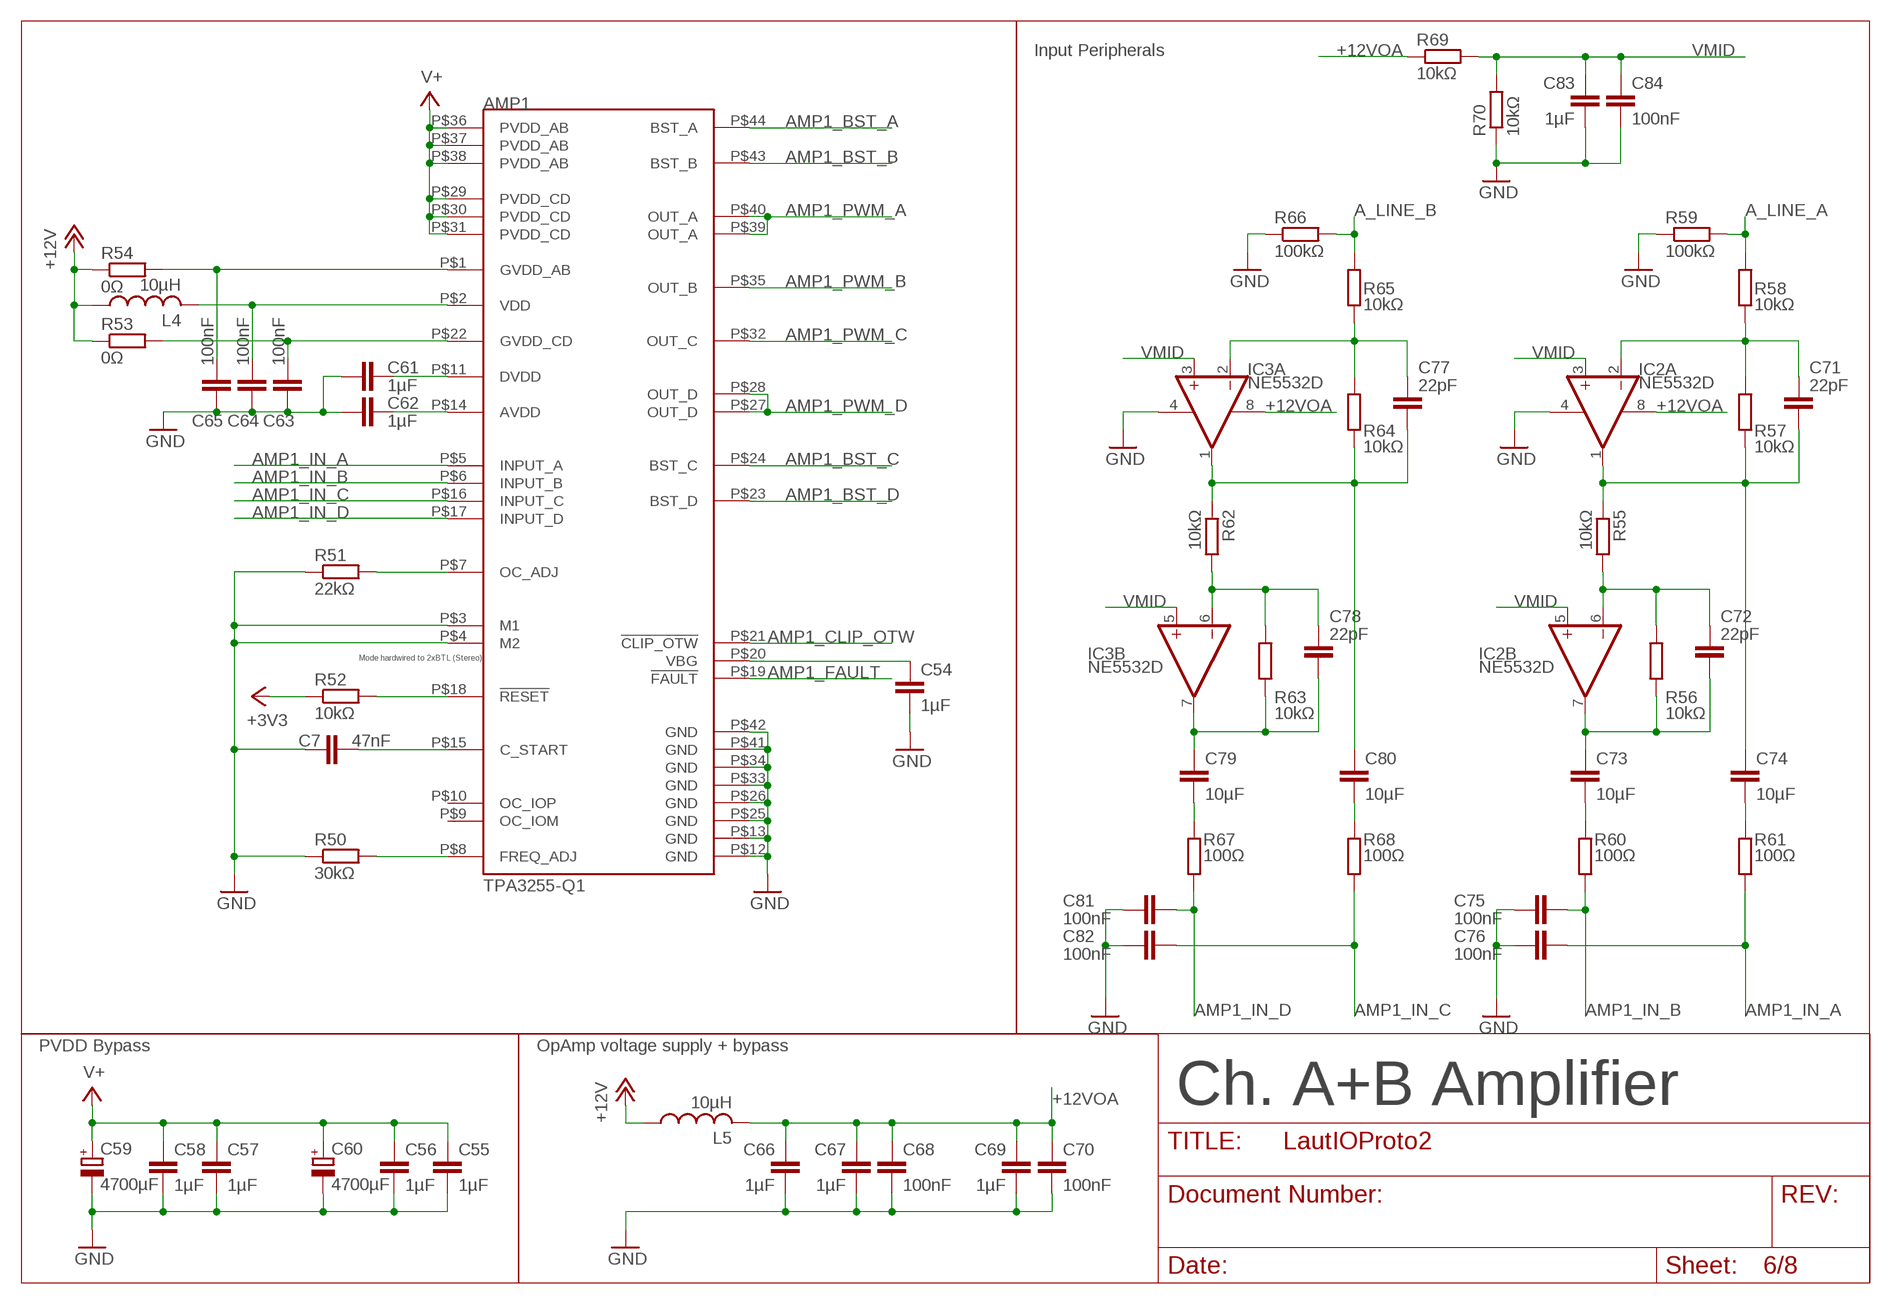
[diagram p5: schematic, sheet 6]

### Parts
AMP1  TPA3255-Q1  [HTSSOP44]
C7  47nF  C-EUC0603  [C0603]
C54  1µF  C-EUC3216  [C3216]
C55  1µF  C-EUC3216  [C3216]
C56  1µF  C-EUC3216  [C3216]
C57  1µF  C-EUC3216  [C3216]
C58  1µF  C-EUC3216  [C3216]
C59  4700µF  CPOL-EUE10-22.5  [EB22,5D]
C60  4700µF  CPOL-EUE10-22.5  [EB22,5D]
C61  1µF  C-EUC3216  [C3216]
C62  1µF  C-EUC3216  [C3216]
C63  100nF  C-EUC0603  [C0603]
C64  100nF  C-EUC0603  [C0603]
C65  100nF  C-EUC0603  [C0603]
C66  1µF  C-EUC3216  [C3216]
C67  1µF  C-EUC3216  [C3216]
C68  100nF  C-EUC0603  [C0603]
C69  1µF  C-EUC3216  [C3216]
C70  100nF  C-EUC0603  [C0603]
C71  22pF  C-EUC0603  [C0603]
C72  22pF  C-EUC0603  [C0603]
C73  10µF  C-EUC3216  [C3216]
C74  10µF  C-EUC3216  [C3216]
C75  100nF  C-EUC0603  [C0603]
C76  100nF  C-EUC0603  [C0603]
C77  22pF  C-EUC0603  [C0603]
C78  22pF  C-EUC0603  [C0603]
C79  10µF  C-EUC3216  [C3216]
C80  10µF  C-EUC3216  [C3216]
C81  100nF  C-EUC0603  [C0603]
C82  100nF  C-EUC0603  [C0603]
C83  1µF  C-EUC3216  [C3216]
C84  100nF  C-EUC0603  [C0603]
IC2  NE5532D  [SO08]
IC3  NE5532D  [SO08]
L4  10µH  L-USL2012C  [L2012C]
L5  10µH  L-USL2012C  [L2012C]
R50  30kΩ  R-EU_R0603  [R0603]
R51  22kΩ  R-EU_R0603  [R0603]
R52  10kΩ  R-EU_R0603  [R0603]
R53  0Ω  R-EU_R0603  [R0603]
R54  0Ω  R-EU_R0603  [R0603]
R55  10kΩ  R-EU_R0603  [R0603]
R56  10kΩ  R-EU_R0603  [R0603]
R57  10kΩ  R-EU_R0603  [R0603]
R58  10kΩ  R-EU_R0603  [R0603]
R59  100kΩ  R-EU_R0603  [R0603]
R60  100Ω  R-EU_R0603  [R0603]
R61  100Ω  R-EU_R0603  [R0603]
R62  10kΩ  R-EU_R0603  [R0603]
R63  10kΩ  R-EU_R0603  [R0603]
R64  10kΩ  R-EU_R0603  [R0603]
R65  10kΩ  R-EU_R0603  [R0603]
R66  100kΩ  R-EU_R0603  [R0603]
R67  100Ω  R-EU_R0603  [R0603]
R68  100Ω  R-EU_R0603  [R0603]
R69  10kΩ  R-EU_R0603  [R0603]
R70  10kΩ  R-EU_R0603  [R0603]

### Nets
+3V3: R52.1 ; also sheet 2,3,4,5,8
+12V: L4.1 L5.1 R53.1 R54.1 ; also sheet 2,3,8
+12VOA: C66.1 C67.1 C68.1 C69.1 C70.1 IC2.8(P:V+) IC3.8(P:V+) L5.2 R69.1
A_LINE_A: R58.1 R59.2 ; also sheet 5
A_LINE_B: R65.1 R66.2 ; also sheet 5
AMP1_BST_A: AMP1.P$44(BST_A) ; also sheet 7
AMP1_BST_B: AMP1.P$43(BST_B) ; also sheet 7
AMP1_BST_C: AMP1.P$24(BST_C) ; also sheet 7
AMP1_BST_D: AMP1.P$23(BST_D) ; also sheet 7
AMP1_CLIP_OTW: AMP1.P$21(!CLIP_OTW) ; also sheet 4
AMP1_FAULT: AMP1.P$19(!FAULT) ; also sheet 4
AMP1_IN_A: AMP1.P$5(INPUT_A) C76.2 R61.2
AMP1_IN_B: AMP1.P$6(INPUT_B) C75.2 R60.2
AMP1_IN_C: AMP1.P$16(INPUT_C) C82.2 R68.2
AMP1_IN_D: AMP1.P$17(INPUT_D) C81.2 R67.2
AMP1_PWM_A: AMP1.P$39(OUT_A) AMP1.P$40(OUT_A) ; also sheet 7
AMP1_PWM_B: AMP1.P$35(OUT_B) ; also sheet 7
AMP1_PWM_C: AMP1.P$32(OUT_C) ; also sheet 7
AMP1_PWM_D: AMP1.P$27(OUT_D) AMP1.P$28(OUT_D) ; also sheet 7
GND: AMP1.P$3(M1) AMP1.P$4(M2) AMP1.P$12(GND) AMP1.P$13(GND) AMP1.P$25(GND) AMP1.P$26(GND) AMP1.P$33(GND) AMP1.P$34(GND) AMP1.P$41(GND) AMP1.P$42(GND) C7.1 C54.2 C55.2 C56.2 C57.2 C58.2 C59.- C60.- C61.2 C62.2 C63.2 C64.2 C65.2 C66.2 C67.2 C68.2 C69.2 C70.2 C75.1 C76.1 C81.1 C82.1 C83.2 C84.2 IC2.4(P:V-) IC3.4(P:V-) R50.1 R51.1 R59.1 R66.1 R70.1 ; also sheet 2,3,4,5,7,8
N$27: AMP1.P$15(C_START) C7.2
N$32: AMP1.P$8(FREQ_ADJ) R50.2
N$39: AMP1.P$7(OC_ADJ) R51.2
N$40: AMP1.P$18(!RESET) R52.2
N$41: AMP1.P$20(VBG) C54.1
N$42: AMP1.P$11(DVDD) C61.1
N$43: AMP1.P$14(AVDD) C62.1
N$44: AMP1.P$1(GVDD_AB) C65.1 R54.2
N$45: AMP1.P$2(VDD) C64.1 L4.2
N$46: AMP1.P$22(GVDD_CD) C63.1 R53.2
N$68: C71.1 IC2.2(A:-IN) R57.1 R58.2
N$69: C71.2 C74.1 IC2.1(A:OUT) R55.1 R57.2
N$70: C72.1 IC2.6(B:-IN) R55.2 R56.1
N$71: C77.1 IC3.2(A:-IN) R64.1 R65.2
N$72: C72.2 C73.1 IC2.7(B:OUT) R56.2
N$73: C77.2 C80.1 IC3.1(A:OUT) R62.1 R64.2
N$74: C78.1 IC3.6(B:-IN) R62.2 R63.1
N$75: C74.2 R61.1
N$76: C73.2 R60.1
N$77: C78.2 C79.1 IC3.7(B:OUT) R63.2
N$78: C80.2 R68.1
N$79: C79.2 R67.1
V+: AMP1.P$29(PVDD_CD) AMP1.P$30(PVDD_CD) AMP1.P$31(PVDD_CD) AMP1.P$36(PVDD_AB) AMP1.P$37(PVDD_AB) AMP1.P$38(PVDD_AB) C55.1 C56.1 C57.1 C58.1 C59.+ C60.+ ; also sheet 2,3,8
VMID: C83.1 C84.1 IC2.3(A:+IN) IC2.5(B:+IN) IC3.3(A:+IN) IC3.5(B:+IN) R69.2 R70.2
Unconnected: AMP1.P$9(OC_IOM) AMP1.P$10(OC_IOP)

### Notes on the sheet
- Input Peripherals
- Mode hardwired to 2xBTL (Stereo)
- PVDD Bypass | OpAmp voltage supply + bypass
- Ch. A+B Amplifier

## Sheet 7 of 8
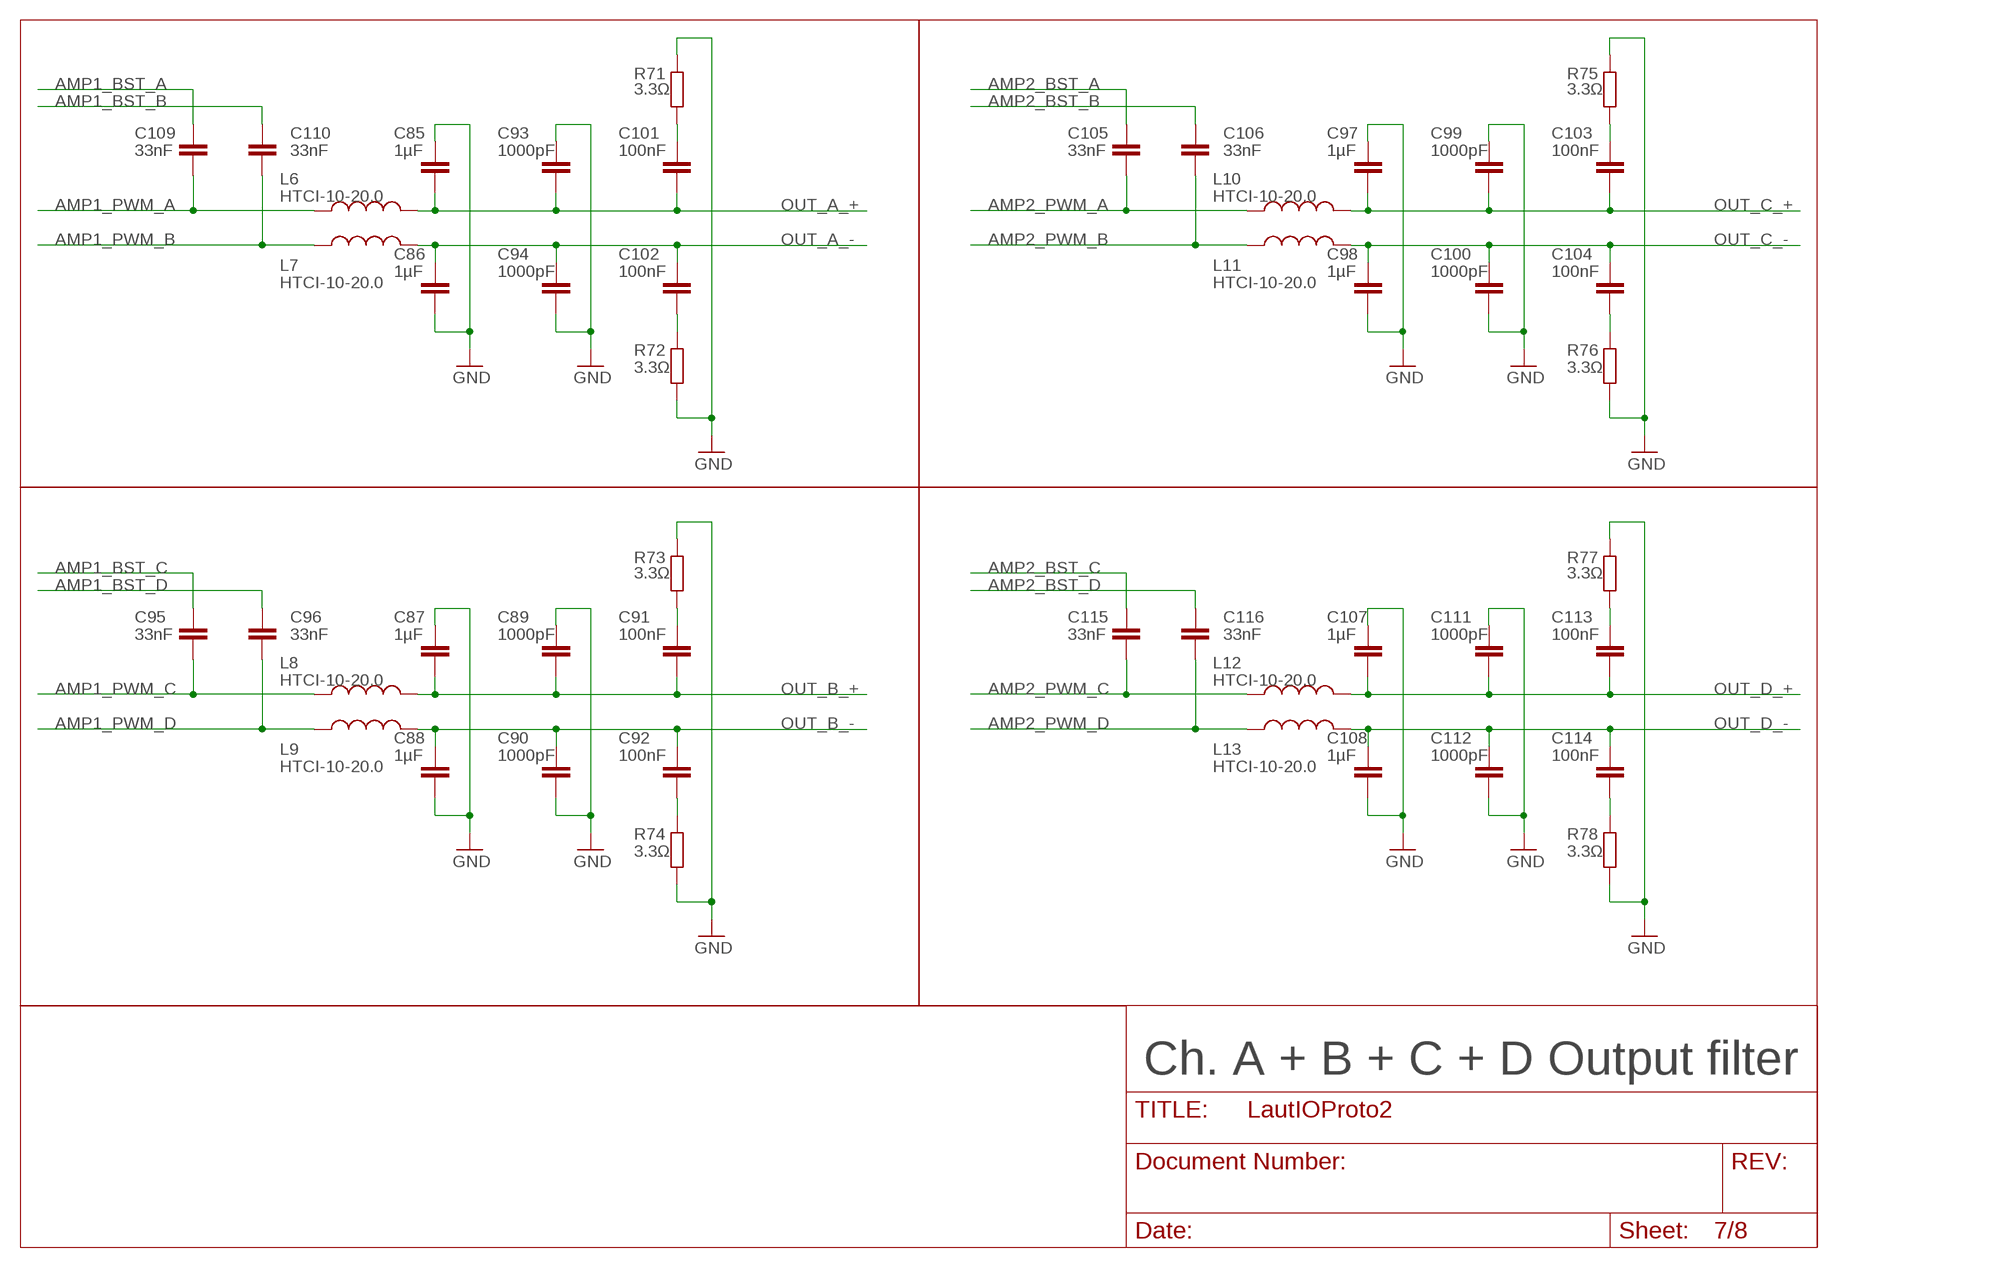
[diagram p6: schematic, sheet 7]

### Parts
C85  1µF  C-EU150-091X182  [C150-091X182]
C86  1µF  C-EU150-091X182  [C150-091X182]
C87  1µF  C-EU150-091X182  [C150-091X182]
C88  1µF  C-EU150-091X182  [C150-091X182]
C89  1000pF  C-EUC0805  [C0805]
C90  1000pF  C-EUC0805  [C0805]
C91  100nF  C-EUC0805  [C0805]
C92  100nF  C-EUC0805  [C0805]
C93  1000pF  C-EUC0805  [C0805]
C94  1000pF  C-EUC0805  [C0805]
C95  33nF  C-EUC0603  [C0603]
C96  33nF  C-EUC0603  [C0603]
C97  1µF  C-EU150-091X182  [C150-091X182]
C98  1µF  C-EU150-091X182  [C150-091X182]
C99  1000pF  C-EUC0805  [C0805]
C100  1000pF  C-EUC0805  [C0805]
C101  100nF  C-EUC0805  [C0805]
C102  100nF  C-EUC0805  [C0805]
C103  100nF  C-EUC0805  [C0805]
C104  100nF  C-EUC0805  [C0805]
C105  33nF  C-EUC0603  [C0603]
C106  33nF  C-EUC0603  [C0603]
C107  1µF  C-EU150-091X182  [C150-091X182]
C108  1µF  C-EU150-091X182  [C150-091X182]
C109  33nF  C-EUC0603  [C0603]
C110  33nF  C-EUC0603  [C0603]
C111  1000pF  C-EUC0805  [C0805]
C112  1000pF  C-EUC0805  [C0805]
C113  100nF  C-EUC0805  [C0805]
C114  100nF  C-EUC0805  [C0805]
C115  33nF  C-EUC0603  [C0603]
C116  33nF  C-EUC0603  [C0603]
L6  HTCI-10-20.0  [HCTI-10-20.0]
L7  HTCI-10-20.0  [HCTI-10-20.0]
L8  HTCI-10-20.0  [HCTI-10-20.0]
L9  HTCI-10-20.0  [HCTI-10-20.0]
L10  HTCI-10-20.0  [HCTI-10-20.0]
L11  HTCI-10-20.0  [HCTI-10-20.0]
L12  HTCI-10-20.0  [HCTI-10-20.0]
L13  HTCI-10-20.0  [HCTI-10-20.0]
R71  3.3Ω  R-EU_R0603  [R0603]
R72  3.3Ω  R-EU_R0603  [R0603]
R73  3.3Ω  R-EU_R0603  [R0603]
R74  3.3Ω  R-EU_R0603  [R0603]
R75  3.3Ω  R-EU_R0603  [R0603]
R76  3.3Ω  R-EU_R0603  [R0603]
R77  3.3Ω  R-EU_R0603  [R0603]
R78  3.3Ω  R-EU_R0603  [R0603]

### Nets
AMP1_BST_A: C109.1 ; also sheet 6
AMP1_BST_B: C110.1 ; also sheet 6
AMP1_BST_C: C95.1 ; also sheet 6
AMP1_BST_D: C96.1 ; also sheet 6
AMP1_PWM_A: C109.2 L6.P$1 ; also sheet 6
AMP1_PWM_B: C110.2 L7.P$1 ; also sheet 6
AMP1_PWM_C: C95.2 L8.P$1 ; also sheet 6
AMP1_PWM_D: C96.2 L9.P$1 ; also sheet 6
AMP2_BST_A: C105.1 ; also sheet 8
AMP2_BST_B: C106.1 ; also sheet 8
AMP2_BST_C: C115.1 ; also sheet 8
AMP2_BST_D: C116.1 ; also sheet 8
AMP2_PWM_A: C105.2 L10.P$1 ; also sheet 8
AMP2_PWM_B: C106.2 L11.P$1 ; also sheet 8
AMP2_PWM_C: C115.2 L12.P$1 ; also sheet 8
AMP2_PWM_D: C116.2 L13.P$1 ; also sheet 8
GND: C85.2 C86.2 C87.2 C88.2 C89.2 C90.2 C93.2 C94.2 C97.2 C98.2 C99.2 C100.2 C107.2 C108.2 C111.2 C112.2 R71.2 R72.2 R73.2 R74.2 R75.2 R76.2 R77.2 R78.2 ; also sheet 2,3,4,5,6,8
N$80: C92.2 R74.1
N$81: C102.2 R72.1
N$82: C101.2 R71.1
N$83: C91.2 R73.1
N$84: C104.2 R76.1
N$85: C103.2 R75.1
N$86: C114.2 R78.1
N$87: C113.2 R77.1
OUT_A_+: C85.1 C93.1 C101.1 L6.P$2 ; also sheet 2
OUT_A_-: C86.1 C94.1 C102.1 L7.P$2 ; also sheet 2
OUT_B_+: C87.1 C89.1 C91.1 L8.P$2 ; also sheet 2
OUT_B_-: C88.1 C90.1 C92.1 L9.P$2 ; also sheet 2
OUT_C_+: C97.1 C99.1 C103.1 L10.P$2 ; also sheet 2
OUT_C_-: C98.1 C100.1 C104.1 L11.P$2 ; also sheet 2
OUT_D_+: C107.1 C111.1 C113.1 L12.P$2 ; also sheet 2
OUT_D_-: C108.1 C112.1 C114.1 L13.P$2 ; also sheet 2

### Notes on the sheet
- Ch. A + B + C + D Output filter

## Sheet 8 of 8
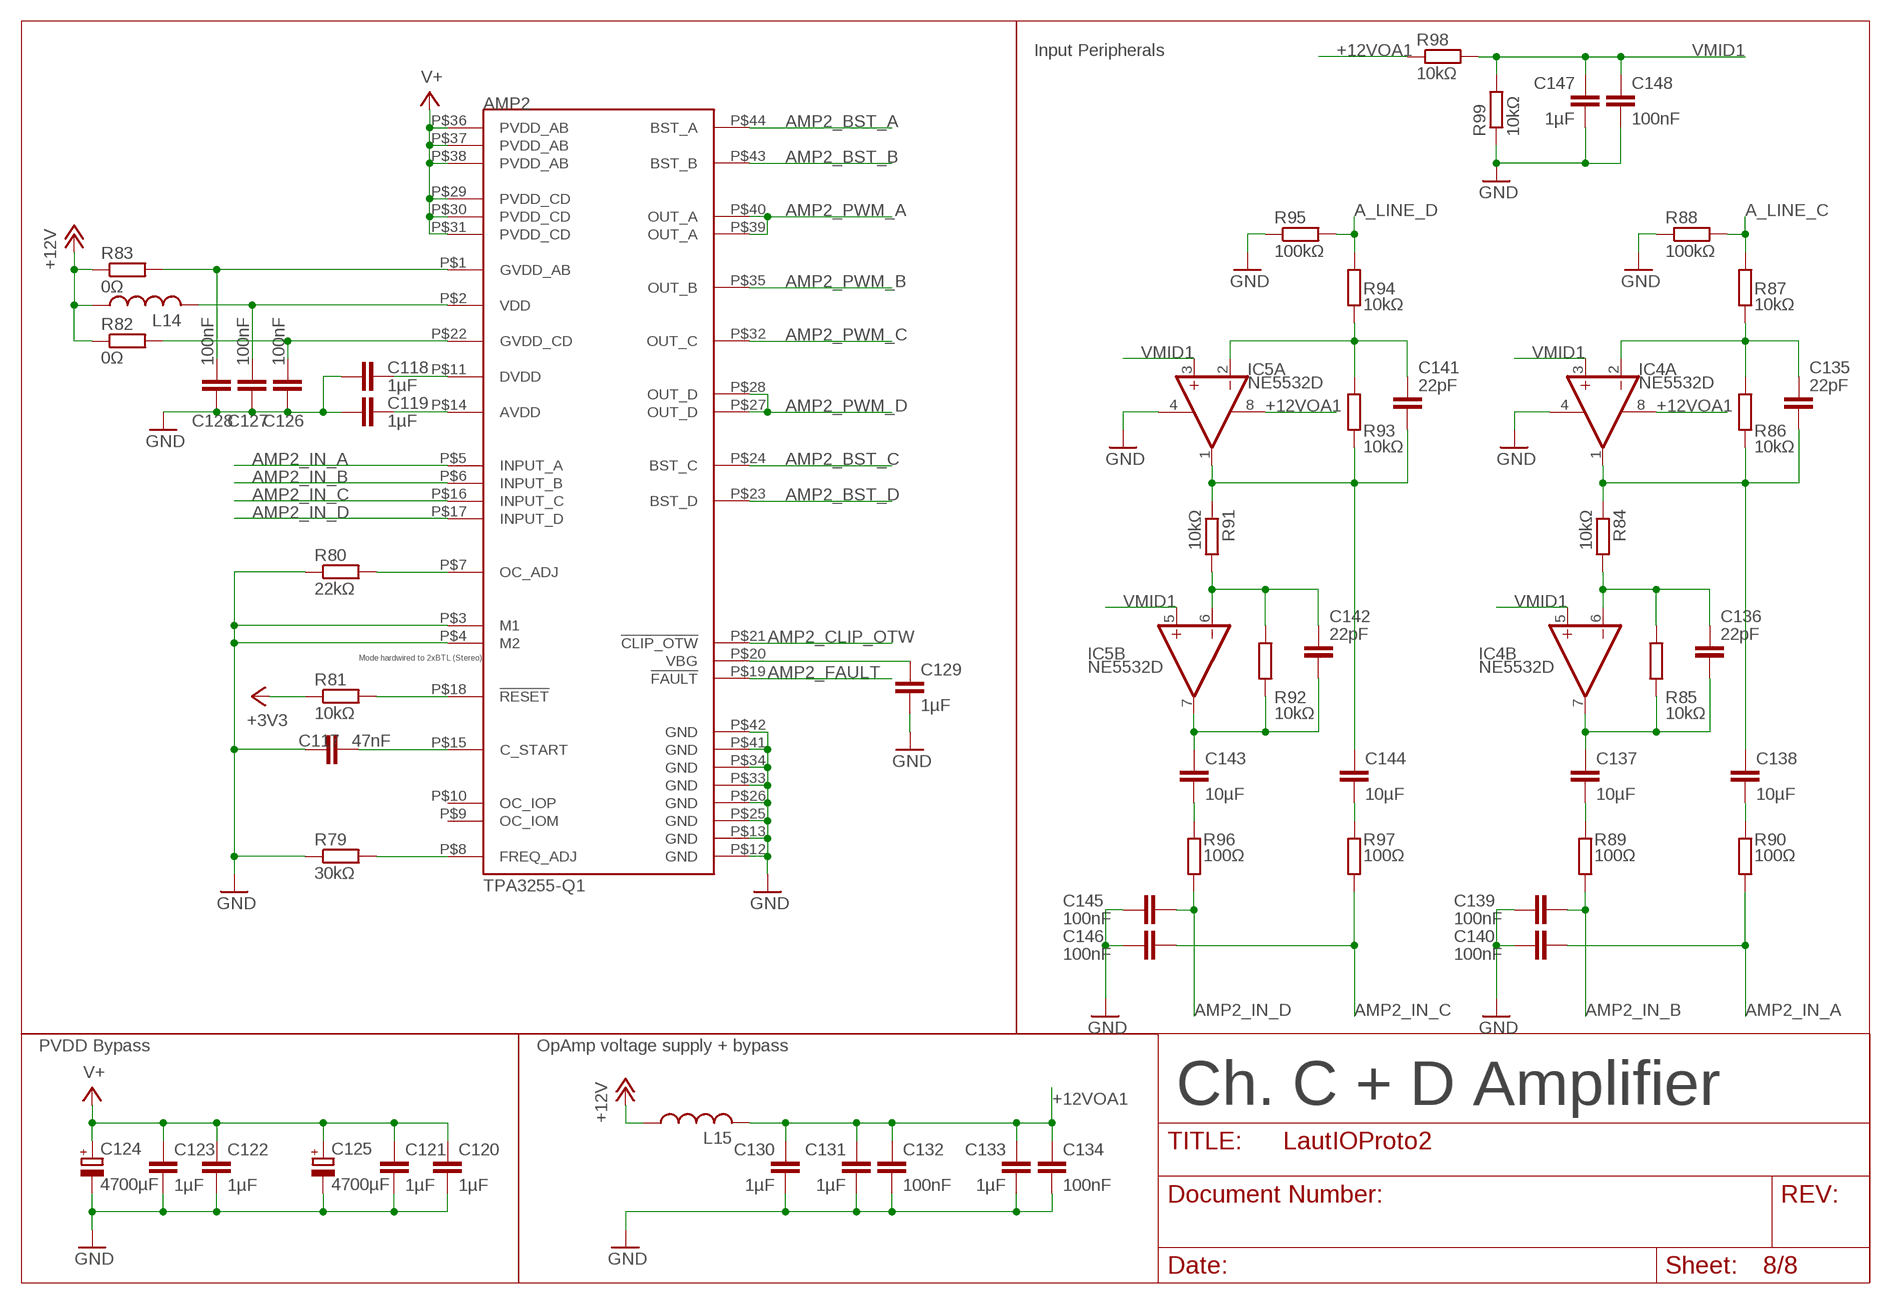
[diagram p7: schematic, sheet 8]

### Parts
AMP2  TPA3255-Q1  [HTSSOP44]
C117  47nF  C-EUC0603  [C0603]
C118  1µF  C-EUC3216  [C3216]
C119  1µF  C-EUC3216  [C3216]
C120  1µF  C-EUC3216  [C3216]
C121  1µF  C-EUC3216  [C3216]
C122  1µF  C-EUC3216  [C3216]
C123  1µF  C-EUC3216  [C3216]
C124  4700µF  CPOL-EUE10-22.5  [EB22,5D]
C125  4700µF  CPOL-EUE10-22.5  [EB22,5D]
C126  100nF  C-EUC0603  [C0603]
C127  100nF  C-EUC0603  [C0603]
C128  100nF  C-EUC0603  [C0603]
C129  1µF  C-EUC3216  [C3216]
C130  1µF  C-EUC3216  [C3216]
C131  1µF  C-EUC3216  [C3216]
C132  100nF  C-EUC0603  [C0603]
C133  1µF  C-EUC3216  [C3216]
C134  100nF  C-EUC0603  [C0603]
C135  22pF  C-EUC0603  [C0603]
C136  22pF  C-EUC0603  [C0603]
C137  10µF  C-EUC3216  [C3216]
C138  10µF  C-EUC3216  [C3216]
C139  100nF  C-EUC0603  [C0603]
C140  100nF  C-EUC0603  [C0603]
C141  22pF  C-EUC0603  [C0603]
C142  22pF  C-EUC0603  [C0603]
C143  10µF  C-EUC3216  [C3216]
C144  10µF  C-EUC3216  [C3216]
C145  100nF  C-EUC0603  [C0603]
C146  100nF  C-EUC0603  [C0603]
C147  1µF  C-EUC3216  [C3216]
C148  100nF  C-EUC0603  [C0603]
IC4  NE5532D  [SO08]
IC5  NE5532D  [SO08]
L14  L-USL2012C  [L2012C]
L15  L-USL2012C  [L2012C]
R79  30kΩ  R-EU_R0603  [R0603]
R80  22kΩ  R-EU_R0603  [R0603]
R81  10kΩ  R-EU_R0603  [R0603]
R82  0Ω  R-EU_R0603  [R0603]
R83  0Ω  R-EU_R0603  [R0603]
R84  10kΩ  R-EU_R0603  [R0603]
R85  10kΩ  R-EU_R0603  [R0603]
R86  10kΩ  R-EU_R0603  [R0603]
R87  10kΩ  R-EU_R0603  [R0603]
R88  100kΩ  R-EU_R0603  [R0603]
R89  100Ω  R-EU_R0603  [R0603]
R90  100Ω  R-EU_R0603  [R0603]
R91  10kΩ  R-EU_R0603  [R0603]
R92  10kΩ  R-EU_R0603  [R0603]
R93  10kΩ  R-EU_R0603  [R0603]
R94  10kΩ  R-EU_R0603  [R0603]
R95  100kΩ  R-EU_R0603  [R0603]
R96  100Ω  R-EU_R0603  [R0603]
R97  100Ω  R-EU_R0603  [R0603]
R98  10kΩ  R-EU_R0603  [R0603]
R99  10kΩ  R-EU_R0603  [R0603]

### Nets
+3V3: R81.1 ; also sheet 2,3,4,5,6
+12V: L14.1 L15.1 R82.1 R83.1 ; also sheet 2,3,6
+12VOA1: C130.1 C131.1 C132.1 C133.1 C134.1 IC4.8(P:V+) IC5.8(P:V+) L15.2 R98.1
A_LINE_C: R87.1 R88.2 ; also sheet 5
A_LINE_D: R94.1 R95.2 ; also sheet 5
AMP2_BST_A: AMP2.P$44(BST_A) ; also sheet 7
AMP2_BST_B: AMP2.P$43(BST_B) ; also sheet 7
AMP2_BST_C: AMP2.P$24(BST_C) ; also sheet 7
AMP2_BST_D: AMP2.P$23(BST_D) ; also sheet 7
AMP2_CLIP_OTW: AMP2.P$21(!CLIP_OTW) ; also sheet 4
AMP2_FAULT: AMP2.P$19(!FAULT) ; also sheet 4
AMP2_IN_A: AMP2.P$5(INPUT_A) C140.2 R90.2
AMP2_IN_B: AMP2.P$6(INPUT_B) C139.2 R89.2
AMP2_IN_C: AMP2.P$16(INPUT_C) C146.2 R97.2
AMP2_IN_D: AMP2.P$17(INPUT_D) C145.2 R96.2
AMP2_PWM_A: AMP2.P$39(OUT_A) AMP2.P$40(OUT_A) ; also sheet 7
AMP2_PWM_B: AMP2.P$35(OUT_B) ; also sheet 7
AMP2_PWM_C: AMP2.P$32(OUT_C) ; also sheet 7
AMP2_PWM_D: AMP2.P$27(OUT_D) AMP2.P$28(OUT_D) ; also sheet 7
GND: AMP2.P$3(M1) AMP2.P$4(M2) AMP2.P$12(GND) AMP2.P$13(GND) AMP2.P$25(GND) AMP2.P$26(GND) AMP2.P$33(GND) AMP2.P$34(GND) AMP2.P$41(GND) AMP2.P$42(GND) C117.1 C118.2 C119.2 C120.2 C121.2 C122.2 C123.2 C124.- C125.- C126.2 C127.2 C128.2 C129.2 C130.2 C131.2 C132.2 C133.2 C134.2 C139.1 C140.1 C145.1 C146.1 C147.2 C148.2 IC4.4(P:V-) IC5.4(P:V-) R79.1 R80.1 R88.1 R95.1 R99.1 ; also sheet 2,3,4,5,6,7
N$88: AMP2.P$8(FREQ_ADJ) R79.2
N$89: AMP2.P$15(C_START) C117.2
N$90: AMP2.P$7(OC_ADJ) R80.2
N$91: AMP2.P$18(!RESET) R81.2
N$92: AMP2.P$20(VBG) C129.1
N$93: AMP2.P$11(DVDD) C118.1
N$94: AMP2.P$14(AVDD) C119.1
N$95: AMP2.P$1(GVDD_AB) C128.1 R83.2
N$96: AMP2.P$2(VDD) C127.1 L14.2
N$97: AMP2.P$22(GVDD_CD) C126.1 R82.2
N$98: C135.1 IC4.2(A:-IN) R86.1 R87.2
N$99: C135.2 C138.1 IC4.1(A:OUT) R84.1 R86.2
N$100: C136.1 IC4.6(B:-IN) R84.2 R85.1
N$101: C136.2 C137.1 IC4.7(B:OUT) R85.2
N$102: C138.2 R90.1
N$103: C137.2 R89.1
N$104: C141.1 IC5.2(A:-IN) R93.1 R94.2
N$105: C141.2 C144.1 IC5.1(A:OUT) R91.1 R93.2
N$106: C142.1 IC5.6(B:-IN) R91.2 R92.1
N$107: C142.2 C143.1 IC5.7(B:OUT) R92.2
N$108: C144.2 R97.1
N$109: C143.2 R96.1
V+: AMP2.P$29(PVDD_CD) AMP2.P$30(PVDD_CD) AMP2.P$31(PVDD_CD) AMP2.P$36(PVDD_AB) AMP2.P$37(PVDD_AB) AMP2.P$38(PVDD_AB) C120.1 C121.1 C122.1 C123.1 C124.+ C125.+ ; also sheet 2,3,6
VMID1: C147.1 C148.1 IC4.3(A:+IN) IC4.5(B:+IN) IC5.3(A:+IN) IC5.5(B:+IN) R98.2 R99.2
Unconnected: AMP2.P$9(OC_IOM) AMP2.P$10(OC_IOP)

### Notes on the sheet
- Input Peripherals
- Mode hardwired to 2xBTL (Stereo)
- PVDD Bypass | OpAmp voltage supply + bypass
- Ch. C + D Amplifier

## Library data of the parts
3V3IO IO1-IO5 IO26 IO27 IO32-IO34 PAD1-PAD8 = wirepad:SMD2: SMD PAD
AMP1 AMP2 = olelib:TPA3255-Q1
AUX_IN_1 = SJ1-3523N:SJ1-3523N: 3.5 mm Right-Angle Stereo Jack, 3 Pin PCB Mount, Non-Threaded; MANUFACTURER: CUI; PARTREV: 1.02; STANDARD: Manufacturer recommendation
AUX_OUT_1 AUX_OUT_2 = con-lstb:MA03-1: PIN HEADER; OC_FARNELL: unknown; OC_NEWARK: unknown
C1 C2 C6 C8 C17 C41 C43 C45 C47 C53 C59 C60 C124 C125 = rcl:CPOL-EU: POLARIZED CAPACITOR, European symbol; SPICEPREFIX: C
C3-C5 C7 C9-C16 C18-C20 C22-C40 C42 C44 C46 C48-C52 C54-C58 C61-C123 C126-C148 = rcl:C-EU: CAPACITOR, European symbol; SPICEPREFIX: C
CHAIN_INPUT CHAIN_OUTPUT = con-lstb:MA06-1: PIN HEADER; OC_FARNELL: unknown; OC_NEWARK: unknown
D1 = olelib:STPS20M100SG-TR
IC1 = linear:*741: OP AMP
IC2-IC5 = linear:NE5532: AUDIO AMPLIFIER
IC6 = silabs:CP210*: Single-Chip USB to UART Bridge Source: www.silabs.com .. CP2101.pdf / cp2102.pdf; MF: FARNELL; MPN: CP2102-GM; OC_FARNELL: 9282130; OC_NEWARK: 30K5635
J1 J2 = o163744v244+Eagle_WR-USB+(rev20e):614004134726: WR-COM USB 2.0 Type A Up Right Kind Properties Durability:1500 Mating cycles Quality Class:1 500 Mating cycles Connector Type:USB Gender:Receptacle Type:Up Right General Information Operating Temperature:-40up to +105 °C Compliance:RoHS Electrical Properties IR 1:1.5 A Working Voltage:30V (AC) Withstanding Voltage:750V (AC) Contact Resistance:20 mΩ Material Properties Insulator Material:PBT Insulator Flammability Rating:UL94 V-0 Color:White Cover Material:Brass Cover Plating:Nickel Contact Material:Copper Alloy Contact Plating:Selective Gold Contact Type:Stamped Shielding Material:Brass Shielding Plating:Nickel <https://www.we-online.com/catalog/media/o32975v209%20Family_WR-COM_614004134726.jpg> Details see: https://www.we-online.com/catalog/en/COM_TYPE_A_UP_RIGHT Updated by Ella Wu 2020-08-14 2020 (C) Würth Elektronik; APPLICATION: USB 2.0; DATASHEET-URL: https://www.we-online.com/catalog/datasheet/614004134726.pdf; GERDER: Receptacle; INTERFACE-TYPE: Type A; IR1: 1.5A; MOUNT: THT; PACKAGING: Tray; PART-NUMBER: 614004134726; PINS: 4; TYPE: Up Right; WORKING-VOLTAGE: 30V(AC)
J3 = DX07S016JA1R1500:DX07S016JA1R1500: USB-C (USB TYPE-C) USB 2.0 Receptacle Connector 24 (16+8 Dummy) Position Surface Mount, Right Angle; Through Hole Check prices <https://pricing.snapeda.com/parts/DX07S016JA1R1500/JAE%20Electronics/view-part?ref=eda>; AVAILABILITY: Warning; DESCRIPTION: USB-C (USB TYPE-C) USB 2.0 Receptacle Connector 24 (16+8 Dummy) Position Surface Mount, Right Angle; Through Hole; MF: JAE Electronics; MP: DX07S016JA1R1500; PACKAGE: None; PRICE: None; PURCHASE-URL: https://pricing.snapeda.com/search/part/DX07S016JA1R1500/?ref=eda
J4 J5 = SparkFun-Connectors:CONN_03: Multi connection point. Often used as Generic Header-pin footprint for 0.1 inch spaced/style header connections On any of the 0.1 inch spaced packages, you can populate with these: Break Away Headers - Straight <https://www.sparkfun.com/products/116> (PRT-00116) Break Away Male Headers - Right Angle <https://www.sparkfun.com/products/553> (PRT-00553) Female Headers <https://www.sparkfun.com/products/115> (PRT-00115) Break Away Headers - Machine Pin <https://www.sparkfun.com/products/117> (PRT-00117) Break Away Female Headers - Swiss Machine Pin <https://www.sparkfun.com/products/743> (PRT-00743) Stackable Header - 3 Pin (Female, 0.1") <https://www.sparkfun.com/products/13875> (PRT-13875) For SCREWTERMINALS and SPRING TERMINALS visit here: Screw Terimnals on SparkFun.com <https://www.sparkfun.com/search/results?term=Screw+Terminals> (5mm/3.5mm/2.54mm spacing) This device is also useful as a general connection point to wire up your design to another part of your project. Our various solder wires solder well into these plated through hole pads. Hook-Up Wire - Assortment (Stranded, 22 AWG) <https://www.sparkfun.com/products/11375> (PRT-11375) Hook-Up Wire - Assortment (Solid Core, 22 AWG) <https://www.sparkfun.com/products/11367> (PRT-11367) View the entire wire category on our website here <https://www.sparkfun.com/categories/141> Special notes: Molex polarized connector foot print use with SKU : PRT-08232 with associated crimp pins and housings.; PROD_ID: XXX-00000
J6 = SparkFun-Connectors:CONN_02: Multi connection point. Often used as Generic Header-pin footprint for 0.1 inch spaced/style header connections On any of the 0.1 inch spaced packages, you can populate with these: Break Away Headers - Straight <https://www.sparkfun.com/products/116> (PRT-00116) Break Away Male Headers - Right Angle <https://www.sparkfun.com/products/553> (PRT-00553) Female Headers <https://www.sparkfun.com/products/115> (PRT-00115) Break Away Headers - Machine Pin <https://www.sparkfun.com/products/117> (PRT-00117) Break Away Female Headers - Swiss Machine Pin <https://www.sparkfun.com/products/743> (PRT-00743) For SCREWTERMINALS and SPRING TERMINALS visit here: Screw Terimnals on SparkFun.com <https://www.sparkfun.com/search/results?term=Screw+Terminals> (5mm/3.5mm/2.54mm spacing) This device is also useful as a general connection point to wire up your design to another part of your project. Our various solder wires solder well into these plated through hole pads. Hook-Up Wire - Assortment (Stranded, 22 AWG) <https://www.sparkfun.com/products/11375> (PRT-11375) Hook-Up Wire - Assortment (Solid Core, 22 AWG) <https://www.sparkfun.com/products/11367> (PRT-11367) View the entire wire category on our website here <https://www.sparkfun.com/categories/141> Special notes: Molex polarized connector foot print use with: PRT-08233 with associated crimp pins and housings. 2.54_SCREWTERM for use with PRT-10571. 3.5mm Screw Terminal footprints for PRT-08084 5mm Screw Terminal footprints for use with PRT-08432
J7 = 1140084168:1140084168: Conn; IC Socket; Micro SD; Right Angle; PCB Mount; MicroSD Ser. Check prices <https://pricing.snapeda.com/parts/1140084168/Amphenol%20Commercial%20Products/view-part?ref=eda>; AVAILABILITY: Good; DESCRIPTION: 10 (8 + 2) Position Card Connector Secure Digital - microSD™ Surface Mount, Right Angle Gold; MF: Amphenol Commercial Products; MP: 1140084168; PACKAGE: None; PRICE: None; PURCHASE-URL: https://pricing.snapeda.com/search/part/1140084168/?ref=eda
L1 = SparkFun-Coils:INDUCTOR: Inductors Resist changes in electrical current. Basically a coil of wire. SparkFun Products: SparkFun Load Cell Amplifier - HX711 <https://www.sparkfun.com/products/13879> IOIO-OTG - V2.2 <https://www.sparkfun.com/products/13613>; PROD_ID: NDUC-12529; VALUE: 27µH/±20%/3.3A
L2-L5 L14 L15 = rcl:L-US: INDUCTOR, American symbol; SPICEPREFIX: L
L6-L13 = olelib:HTCI-10-20.0
LED_SYS = led:LED: LED OSRAM: - CHIPLED LG R971, LG N971, LY N971, LG Q971, LY Q971, LO R971, LY R971 LH N974, LH R974 LS Q976, LO Q976, LY Q976 LO Q996 - Hyper CHIPLED LW Q18S LB Q993, LB Q99A, LB R99A - SideLED LS A670, LO A670, LY A670, LG A670, LP A670 LB A673, LV A673, LT A673, LW A673 LH A674 LY A675 LS A676, LA A676, LO A676, LY A676, LW A676 LS A679, LY A679, LG A679 - Hyper Micro SIDELED® LS Y876, LA Y876, LO Y876, LY Y876 LT Y87S - SmartLED LW L88C, LW L88S LB L89C, LB L89S, LG L890 LS L89K, LO L89K, LY L89K LS L896, LA L896, LO L896, LY L896 - TOPLED LS T670, LO T670, LY T670, LG T670, LP T670 LSG T670, LSP T670, LSY T670, LOP T670, LYG T670 LG T671, LOG T671, LSG T671 LB T673, LV T673, LT T673, LW T673 LH T674 LS T676, LA T676, LO T676, LY T676, LB T676, LH T676, LSB T676, LW T676 LB T67C, LV T67C, LT T67C, LS T67K, LO T67K, LY T67K, LW E67C LS E67B, LA E67B, LO E67B, LY E67B, LB E67C, LV E67C, LT E67C LW T67C LS T679, LY T679, LG T679 LS T770, LO T770, LY T770, LG T770, LP T770 LB T773, LV T773, LT T773, LW T773 LH T774 LS E675, LA E675, LY E675, LS T675 LS T776, LA T776, LO T776, LY T776, LB T776 LHGB T686 LT T68C, LB T68C - Hyper Mini TOPLED® LB M676 - Mini TOPLED Santana® LG M470 LS M47K, LO M47K, LY M47K Source: http://www.osram.convergy.de LUXEON: - LUMILED® LXK2-PW12-R00, LXK2-PW12-S00, LXK2-PW14-U00, LXK2-PW14-V00 LXK2-PM12-R00, LXK2-PM12-S00, LXK2-PM14-U00 LXK2-PE12-Q00, LXK2-PE12-R00, LXK2-PE12-S00, LXK2-PE14-T00, LXK2-PE14-U00 LXK2-PB12-K00, LXK2-PB12-L00, LXK2-PB12-M00, LXK2-PB14-N00, LXK2-PB14-P00, LXK2-PB14-Q00 LXK2-PR12-L00, LXK2-PR12-M00, LXK2-PR14-Q00, LXK2-PR14-R00 LXK2-PD12-Q00, LXK2-PD12-R00, LXK2-PD12-S00 LXK2-PH12-R00, LXK2-PH12-S00 LXK2-PL12-P00, LXK2-PL12-Q00, LXK2-PL12-R00 Source: www.luxeon.com KINGBRIGHT: KA-3528ASYC Source: www.kingbright.com
POT0 POT1-POT3 = pot:TRIM_EU-: POTENTIOMETER
Q1 Q2 = transistor-npn:BC849*: NPN Transistor
Q3 = transistor-pnp:FZT753SMD: PNP Transistor
Q4 = crystal:CSM-7X-DU: SMD CRYSTAL Source: www.ecsxtal.com .. Crystal 3.6864MHz CSM_7X_DU.PDF; OC_FARNELL: unknown; OC_NEWARK: unknown
R1-R22 R28-R99 = rcl:R-EU_: RESISTOR, European symbol; SPICEPREFIX: R
REG1 = olelib:TPS54560B-Q1
REG2 REG3 = olelib:TPS54339DDA; BUILT_BY: EMA_UL_Team; MANUFACTURER_PART_NUMBER: TPS54339DDA; SOURCELIBRARY: TI_2017-02-16; VENDOR: Texas Instruments
S1 S2 = SparkFun-Switches:MOMENTARY-SWITCH-SPST: Momentary Switch (Pushbutton) - SPST Normally-open (NO) SPST momentary switches (buttons, pushbuttons). Variants PTH-12MM - 12mm square, through-hole Momentary Pushbutton Switch - 12mm Square <https://www.sparkfun.com/products/9190> (COM-09190) PTH-6.0MM, PTH-6.0MM-KIT - 6.0mm square, through-hole Mini Pushbutton Switch <https://www.sparkfun.com/products/97> (COM-00097) KIT package intended for soldering kit's - only one side of pads' copper is exposed. PTH-RIGHT-ANGLE-KIT - Right-angle, through-hole Right Angle Tactile Button <https://www.sparkfun.com/products/10791> - Used on SparkFun BigTime Watch Kit <https://www.sparkfun.com/products/11734> SMD-12MM - 12mm square, surface-mount Tactile Button - SMD (12mm) <https://www.sparkfun.com/products/12993> (COM-12993) Used on SparkFun PicoBoard <https://www.sparkfun.com/products/11888> SMD-4.5MM - 4.5mm Square Trackball Switch Used on SparkFun Blackberry Trackballer Breakout <https://www.sparkfun.com/products/13169> SMD-4.6MMX2.8MM - 4.60mm x 2.80mm, surface mount Used on SparkFun SAMD21 Mini Breakout <https://www.sparkfun.com/products/13664> SMD-5.2MM, SMD-5.2-REDUNDANT - 5.2mm square, surface-mount Mini Pushbutton Switch - SMD <https://www.sparkfun.com/products/8720> (COM-08720) Used on Arduino Pro Mini <https://www.sparkfun.com/products/11114> REDUNDANT package connects both switch circuits together SMD-6.0X3.5MM - 6.0 x 3.5mm, surface mount Momentary Reset Switch SMD <https://www.sparkfun.com/products/8229> (COM-08229) SMD-6.2MM-TALL - 6.2mm square, surface mount Tactile Button - SMD (6mm) <https://www.sparkfun.com/products/12992> Used on SparkFun Digital Sandbox <https://www.sparkfun.com/products/12651> SMD-RIGHT-ANGLE - Right-angle, surface mount Used on SparkFun Block for Intel® Edison - Arduino <https://www.sparkfun.com/products/13036>; PROD_ID: SWCH-11966; SF_SKU: COM-12992
SJ1 = jumper:SJ2W: SMD solder JUMPER
SJ2 SJ6-SJ9 = jumper:SJ: SMD solder JUMPER
U1 = esp32:ESP-WROOM-32: Espressif Systems ESP-WROOM-32
U3 = olelib:ADAU1701JSTZ; BUILT_BY: EMA_UL_Team; MANUFACTURER_PART_NUMBER: ADAU1701JSTZ; SOURCELIBRARY: Analog_2015-01-06; VENDOR: Analog Devices Inc
U$1 = XT60:XT60: XT60
VD1 = usblc6:USBLC6-2: VERY LOW CAPACITANCE ESD PROTECTION 2 line Datasheet link <http://www.st.com/web/catalog/sense_power/FM114/CL1137/SC1489/PF93353>
X1 X2 = con-phoenix-508:MKDSN1,5/2-5,08: MKDSN 1,5/ 2-5,08 Printklemme Nennstrom: 13,5 A Nennspannung: 250 V Rastermaß: 5,08 mm Polzahl: 2 Anschlussart: Schraubanschluss Montage: Löten Anschlussrichtung Leiter/Platine: 0 ° Artikelnummer: 1729128 Source: http://eshop.phoenixcontact.com .. 1729128.pdf